# Altium project S6.PrjPCB
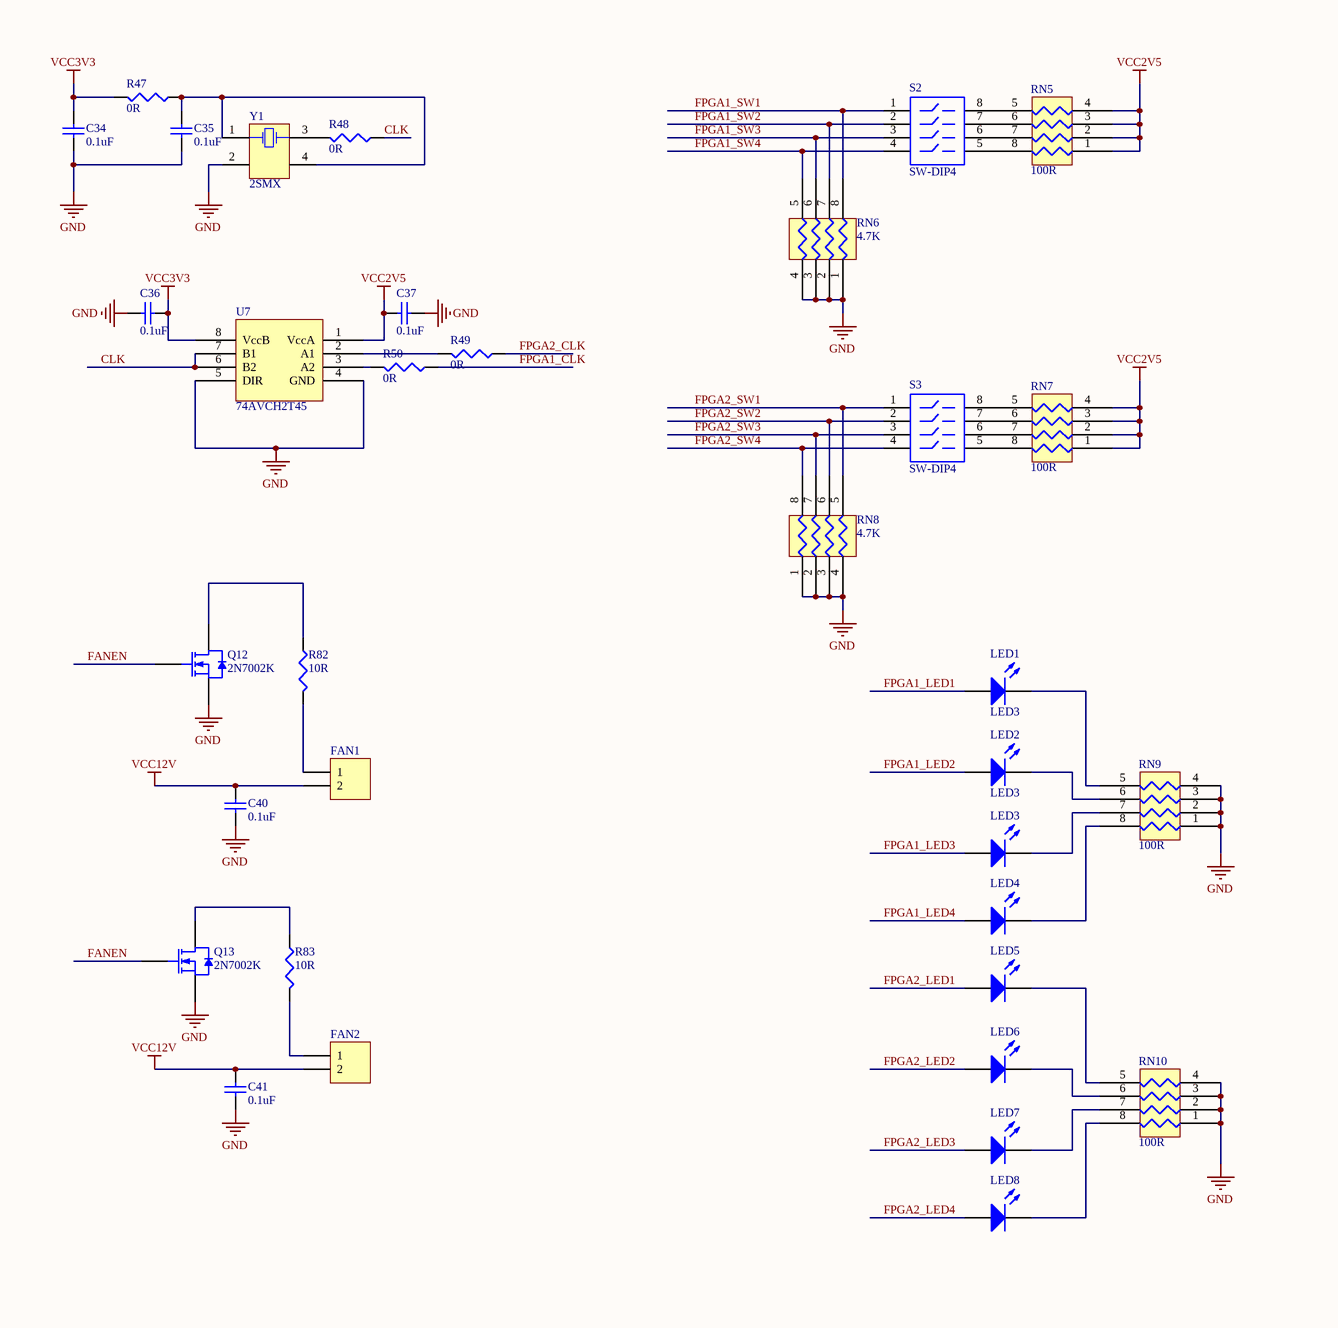
[diagram p0: S6.SchDoc, left]
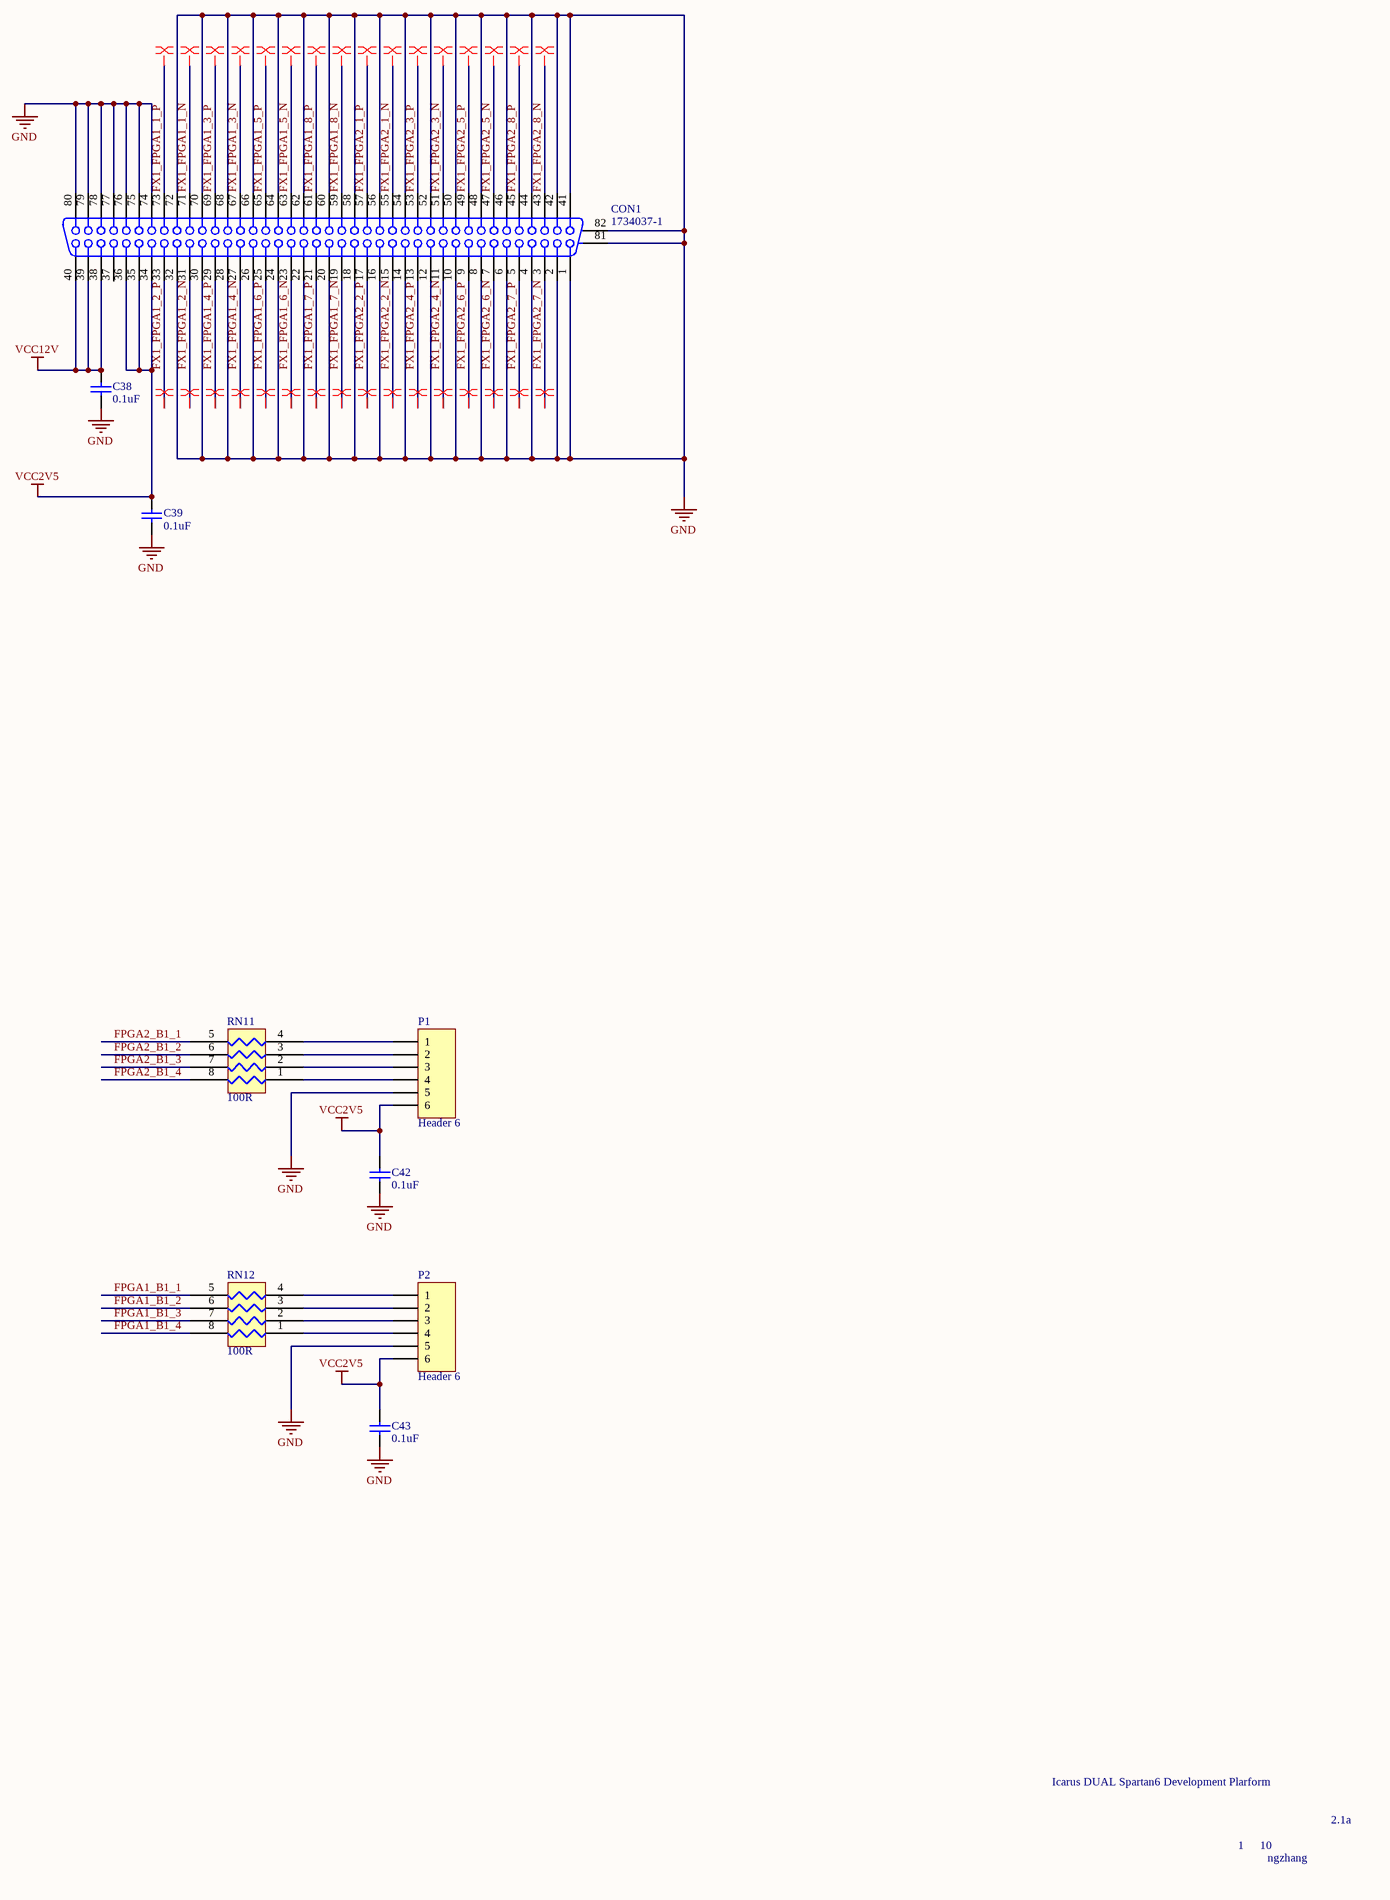
[diagram p1: S6.SchDoc, right]
7 sheets, 298 parts. Net scope: global (net labels, ports and power ports of the same name join across sheets).
Board file: S6.PcbDoc
Sheets:
  S6.SchDoc
  POWER_IO.SchDoc
  POWER.SchDoc
  DIMM_CONNECTOR.SchDoc
  USB2UART.SchDoc
  FPGA1_POWER.SchDoc
  FPGA2_POWER.SchDoc

## Sheet S6.SchDoc
size A2

### Parts
C34  0.1uF  [1608[0603]]
C35  0.1uF  [1608[0603]]
C36  0.1uF  [1608[0603]]
C37  0.1uF  [1608[0603]]
C38  0.1uF  [1608[0603]]
C39  0.1uF  [1608[0603]]
C40  0.1uF  [1608[0603]]
C41  0.1uF  [1608[0603]]
C42  0.1uF  [1608[0603]]
C43  0.1uF  [1608[0603]]
CON1  1734037-1  [1734037-1]
FAN1  Header 2  [2PINFAN]  (value not drawn)
FAN2  Header 2  [2PINFAN]  (value not drawn)
LED1  LED3  [CD1608-0603]
LED2  LED3  [CD1608-0603]
LED3  LED3  [CD1608-0603]  (value not drawn)
LED4  LED3  [CD1608-0603]  (value not drawn)
LED5  LED3  [CD1608-0603]  (value not drawn)
LED6  LED3  [CD1608-0603]  (value not drawn)
LED7  LED3  [CD1608-0603]  (value not drawn)
LED8  LED3  [CD1608-0603]  (value not drawn)
P1  Header 6  [HDR1X6]
P2  Header 6  [HDR1X6]
Q12  2N7002K  [SOT23_N]
Q13  2N7002K  [SOT23_N]
R47  0R  [J1-0603]
R48  0R  [J1-0603]
R49  0R  [J1-0603]
R50  0R  [J1-0603]
R82  10R  [J1-0603]
R83  10R  [J1-0603]
RN5  100R  [EXBV8V]
RN6  4.7K  [EXBV8V]
RN7  100R  [EXBV8V]
RN8  4.7K  [EXBV8V]
RN9  100R  [EXBV8V]
RN10  100R  [EXBV8V]
RN11  100R  [EXBV8V]
RN12  100R  [EXBV8V]
S2  SW-DIP4  [SO8_N]
S3  SW-DIP4  [SO8_N]
U7  74AVCH2T45  [SOT765-1]
Y1  2SMX  [SMX2]

### Nets
GND: C34.1 C35.1 C36.2 C37.1 C38.1 C39.1 C40.2 C41.2 C42.1 C43.1 CON1.1 CON1.2 CON1.4 CON1.6 CON1.8 CON1.10 CON1.12 CON1.14 CON1.16 CON1.18 CON1.20 CON1.22 CON1.24 CON1.26 CON1.28 CON1.30 CON1.32 CON1.41 CON1.42 CON1.44 CON1.46 CON1.48 CON1.50 CON1.52 CON1.54 CON1.56 CON1.58 CON1.60 CON1.62 CON1.64 CON1.66 CON1.68 CON1.70 CON1.72 CON1.74 CON1.75 CON1.76 CON1.77 CON1.78 CON1.79 CON1.80 CON1.81(MH1) CON1.82(MH2) P1.5 P2.5 Q12.2(S) Q13.2(S) RN6.1 RN6.2 RN6.3 RN6.4 RN8.1 RN8.2 RN8.3 RN8.4 RN9.1 RN9.2 RN9.3 RN9.4 RN10.1 RN10.2 RN10.3 RN10.4 U7.4(GND) U7.5(DIR) Y1.2(NC)
VCC2V5: C37.2 C39.2 C42.2 C43.2 CON1.34 CON1.35 CON1.36 P1.6 P2.6 RN5.1 RN5.2 RN5.3 RN5.4 RN7.1 RN7.2 RN7.3 RN7.4 U7.1(VccA)  [project net VREF_OUT]
VCC3V3: C34.2 C36.1 R47.2 U7.8(VccB)
VCC12V: C38.2 C40.1 C41.1 CON1.38 CON1.39 CON1.40 FAN1.2 FAN2.2
CLK: R48.1 U7.6(B2) U7.7(B1)
FANEN: Q12.1(G) Q13.1(G)
FPGA1_B1_1: RN12.5
FPGA1_B1_2: RN12.6
FPGA1_B1_3: RN12.7
FPGA1_B1_4: RN12.8
FPGA1_CLK: R50.1
FPGA1_LED1: LED1.1(A)
FPGA1_LED2: LED2.1(A)
FPGA1_LED3: LED3.1(A)
FPGA1_LED4: LED4.1(A)
FPGA1_SW1: RN6.8 S2.1
FPGA1_SW2: RN6.7 S2.2
FPGA1_SW3: RN6.6 S2.3
FPGA1_SW4: RN6.5 S2.4
FPGA2_B1_1: RN11.5
FPGA2_B1_2: RN11.6
FPGA2_B1_3: RN11.7
FPGA2_B1_4: RN11.8
FPGA2_CLK: R49.1
FPGA2_LED1: LED5.1(A)
FPGA2_LED2: LED6.1(A)
FPGA2_LED3: LED7.1(A)
FPGA2_LED4: LED8.1(A)
FPGA2_SW1: RN8.5 S3.1
FPGA2_SW2: RN8.6 S3.2
FPGA2_SW3: RN8.7 S3.3
FPGA2_SW4: RN8.8 S3.4
FX1_FPGA1_1_N: CON1.71
FX1_FPGA1_1_P: CON1.73
FX1_FPGA1_2_N: CON1.31
FX1_FPGA1_2_P: CON1.33
FX1_FPGA1_3_N: CON1.67
FX1_FPGA1_3_P: CON1.69
FX1_FPGA1_4_N: CON1.27
FX1_FPGA1_4_P: CON1.29
FX1_FPGA1_5_N: CON1.63
FX1_FPGA1_5_P: CON1.65
FX1_FPGA1_6_N: CON1.23
FX1_FPGA1_6_P: CON1.25
FX1_FPGA1_7_N: CON1.19
FX1_FPGA1_7_P: CON1.21
FX1_FPGA1_8_N: CON1.59
FX1_FPGA1_8_P: CON1.61
FX1_FPGA2_1_N: CON1.55
FX1_FPGA2_1_P: CON1.57
FX1_FPGA2_2_N: CON1.15
FX1_FPGA2_2_P: CON1.17
FX1_FPGA2_3_N: CON1.51
FX1_FPGA2_3_P: CON1.53
FX1_FPGA2_4_N: CON1.11
FX1_FPGA2_4_P: CON1.13
FX1_FPGA2_5_N: CON1.47
FX1_FPGA2_5_P: CON1.49
FX1_FPGA2_6_N: CON1.7
FX1_FPGA2_6_P: CON1.9
FX1_FPGA2_7_N: CON1.3
FX1_FPGA2_7_P: CON1.5
FX1_FPGA2_8_N: CON1.43
FX1_FPGA2_8_P: CON1.45
NetC35_2: C35.2 R47.1 Y1.1(OSC1) Y1.4(NC)
NetFAN1_1: FAN1.1 R82.2
NetFAN2_1: FAN2.1 R83.2
NetLED1_2: LED1.2(K) RN9.5
NetLED2_2: LED2.2(K) RN9.6
NetLED3_2: LED3.2(K) RN9.7
NetLED4_2: LED4.2(K) RN9.8
NetLED5_2: LED5.2(K) RN10.5
NetLED6_2: LED6.2(K) RN10.6
NetLED7_2: LED7.2(K) RN10.7
NetLED8_2: LED8.2(K) RN10.8
NetP1_1: P1.1 RN11.4
NetP1_2: P1.2 RN11.3
NetP1_3: P1.3 RN11.2
NetP1_4: P1.4 RN11.1
NetP2_1: P2.1 RN12.4
NetP2_2: P2.2 RN12.3
NetP2_3: P2.3 RN12.2
NetP2_4: P2.4 RN12.1
NetQ12_3: Q12.3(D) R82.1
NetQ13_3: Q13.3(D) R83.1
NetR48_2: R48.2 Y1.3(OSC2)
NetR49_2: R49.2 U7.2(A1)
NetR50_2: R50.2 U7.3(A2)
NetRN5_5: RN5.5 S2.8
NetRN5_6: RN5.6 S2.7
NetRN5_7: RN5.7 S2.6
NetRN5_8: RN5.8 S2.5
NetRN7_5: RN7.5 S3.8
NetRN7_6: RN7.6 S3.7
NetRN7_7: RN7.7 S3.6
NetRN7_8: RN7.8 S3.5

Not connected (* = marked no-connect by the designer): CON1 37

### Layout directives
differential pair: FX1_FPGA1_1_N, FX1_FPGA1_1_P, FX1_FPGA1_2_N, FX1_FPGA1_2_P, FX1_FPGA1_3_N, FX1_FPGA1_3_P, FX1_FPGA1_4_N, FX1_FPGA1_4_P, FX1_FPGA1_5_N, FX1_FPGA1_5_P, FX1_FPGA1_6_N, FX1_FPGA1_6_P, FX1_FPGA1_7_N, FX1_FPGA1_7_P, FX1_FPGA1_8_N, FX1_FPGA1_8_P, FX1_FPGA2_1_N, FX1_FPGA2_1_P, FX1_FPGA2_2_N, FX1_FPGA2_2_P, FX1_FPGA2_3_N, FX1_FPGA2_3_P, FX1_FPGA2_4_N, FX1_FPGA2_4_P, FX1_FPGA2_5_N, FX1_FPGA2_5_P, FX1_FPGA2_6_N, FX1_FPGA2_6_P, FX1_FPGA2_7_N, FX1_FPGA2_7_P, FX1_FPGA2_8_N, FX1_FPGA2_8_P

### Notes on the sheet
- Icarus DUAL Spartan6 Development Plarform
- 1
- 10
- ngzhang
- 2.1a

### Library data of the parts
C34-C43 = Cap Semi: Capacitor (Semiconductor SIM Model); Published: 8-Jun-2000; LatestRevisionDate: 29-May-2009; LatestRevisionNote: IPC-7351 Footprint Added.; PackageReference: C1206; Publisher: Altium Limited; PackageDescription: Chip Capacitor; Value: 0.1uF
FAN1 FAN2 = Header 2: Header, 2-Pin; LatestRevisionDate: 17-Jul-2002; LatestRevisionNote: Re-released for DXP Platform.; Publisher: Altium Limited
LED1-LED8 = LED3: Typical BLUE SiC LED; Published: 8-Jun-2000; LatestRevisionDate: 17-Dec-2003; LatestRevisionNote: PCB Footprint replaced.; DatasheetVersion: 16-Apr-2002; PackageVersion: 16-Apr-2002; PackageReference: 3.5X2.8X1.9; Publisher: Altium Limited; PackageDescription: SM LED; 2 C-Bend Leads; Body 3.5 x 2.8 x 1.9 mm, inc leads (LxWxH typ)
P1 P2 = Header 6: Header, 6-Pin; LatestRevisionDate: 17-Jul-2002; LatestRevisionNote: Re-released for DXP Platform.; Publisher: Altium Limited
Q12 Q13 = 2N7002: N-channel Enhancement Mode Field-effect Transistor; Published: 17-Sep-2003; LatestRevisionDate: 12-Dec-2006; LatestRevisionNote: IPC-7351 Footprint Added.; DatasheetVersion: 27-Jul-2000; PackageVersion: May-1999; PackageReference: SOT23; Publisher: Altium Limited; PackageDescription: 3-Pin SOT-23 Package 0.95 mm Pitch, 2.3 mm Lead Span; ComponentLink1Description: Manufacturer Link; ComponentLink1URL: http://www.semiconductors.philips.com/; ComponentLink2Description: Datasheet; ComponentLink2URL: http://www.semiconductors.philips.com/acrobat/datasheets/2N7002_4.pdf
R47-R50 R82 R83 = Res3: Resistor; Published: 8-Jun-2000; LatestRevisionDate: 29-May-2009; LatestRevisionNote: IPC-7351 Footprint Added.; PackageReference: J1-0603; Publisher: Altium Limited; PackageDescription: Chip Resistor
  R47-R50: Value: 0R
  R82 R83: Value: 10R
RN5-RN12 = RES4PACK
S2 S3 = SW-DIP4: DIP Switch; Published: 24-Mar-1999; LatestRevisionDate: 17-Jul-2002; LatestRevisionNote: Re-released for DXP Platform.; PackageReference: DIP-8; Publisher: Altium Limited
Y1 = 2SMX: Surface Mount Quartz Crystal; Note: PCB layout complies with manufacturer's recommendation.; Published: 17-Jul-2002; DatasheetDocument: 9-Sep-1999; PackageDocument: 9-Sep-1999; PackageReference: 2SMX; Publisher: Altium Limited; ComponentLink1Description: Manufacturer Link; ComponentLink1URL: http://www.cmac.com/mt/

## Sheet POWER_IO.SchDoc
size A4
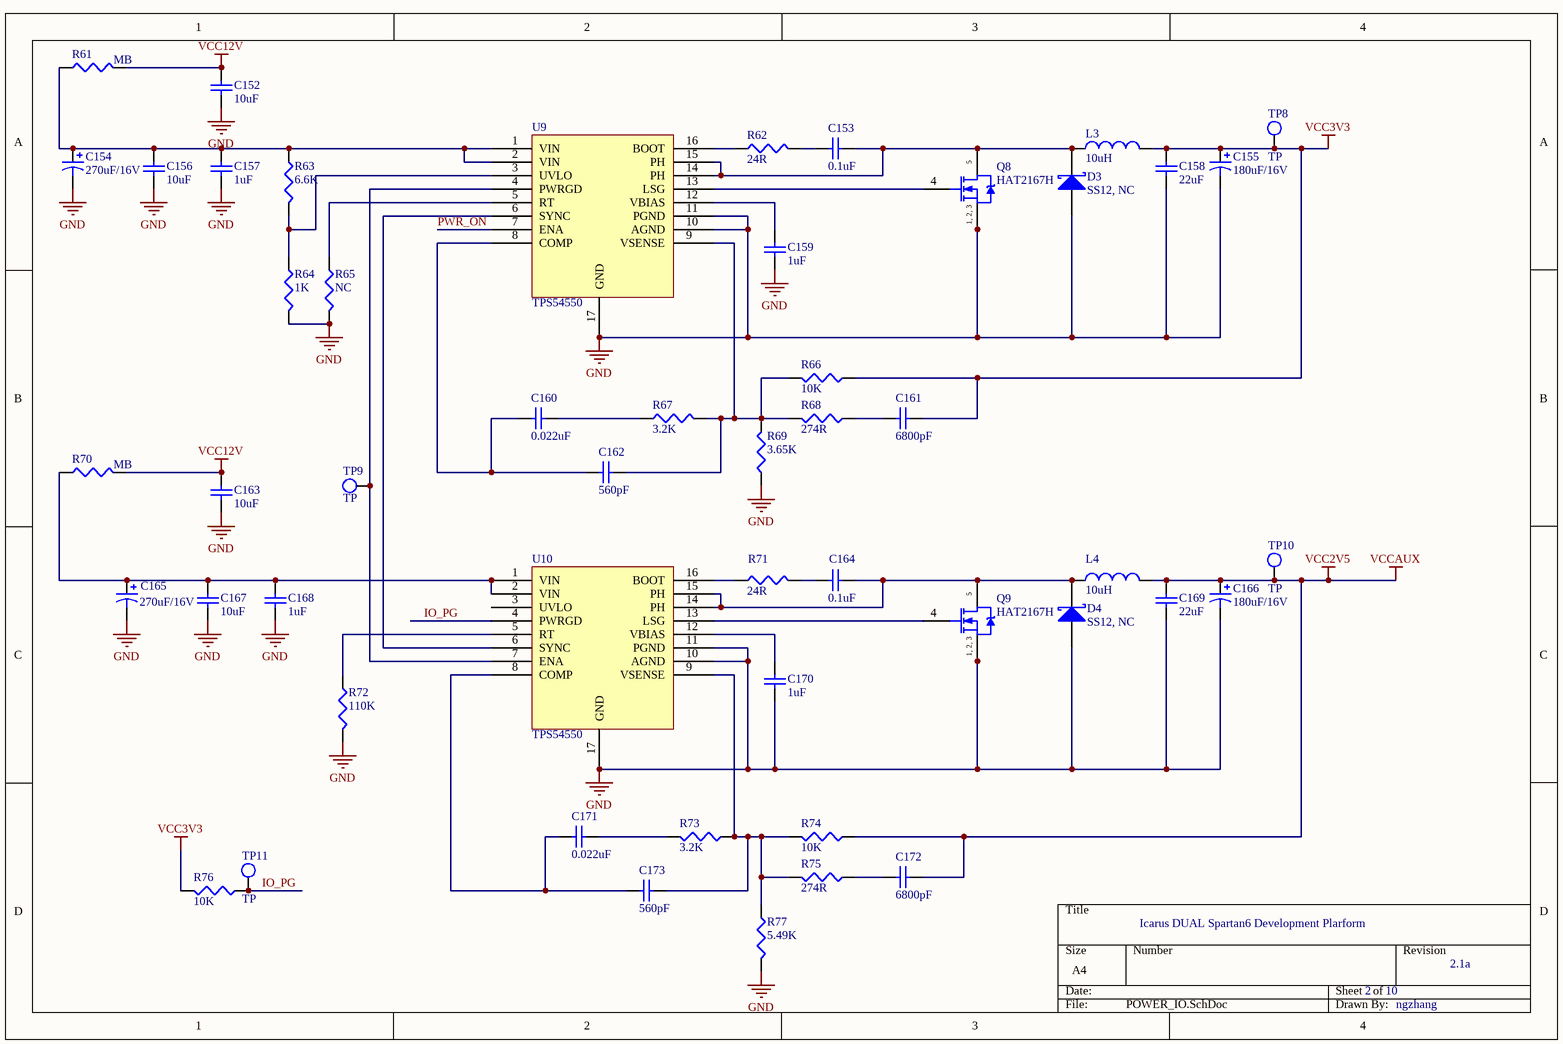
[diagram p2: POWER_IO.SchDoc]

### Parts
C152  10uF  [C1206]
C153  0.1uF  [1608[0603]]
C154  270uF/16V  [CAP8X8]
C155  180uF/16V  [CAP8X8]
C156  10uF  [C1206]
C157  1uF  [1608[0603]]
C158  22uF  [C1206]
C159  1uF  [1608[0603]]
C160  0.022uF  [1608[0603]]
C161  6800pF  [1608[0603]]
C162  560pF  [1608[0603]]
C163  10uF  [C1206]
C164  0.1uF  [1608[0603]]
C165  270uF/16V  [CAP8X8]
C166  180uF/16V  [CAP8X8]
C167  10uF  [C1206]
C168  1uF  [1608[0603]]
C169  22uF  [C1206]
C170  1uF  [1608[0603]]
C171  0.022uF  [1608[0603]]
C172  6800pF  [1608[0603]]
C173  560pF  [1608[0603]]
D3  SS12, NC  [SMA]
D4  SS12, NC  [SMA]
L3  value 10uH  [IHLP4040]  (hidden comment: IHLP4040DZ11)
L4  value 10uH  [IHLP4040]  (hidden comment: IHLP4040DZ11)
Q8  HAT2167H  [LFPAK]
Q9  HAT2167H  [LFPAK]
R61  MB  [C1206]
R62  24R  [J1-0603]
R63  6.6K  [J1-0603]
R64  1K  [J1-0603]
R65  NC  [J1-0603]
R66  10K  [J1-0603]
R67  3.2K  [J1-0603]
R68  274R  [J1-0603]
R69  3.65K  [J1-0603]
R70  MB  [C1206]
R71  24R  [J1-0603]
R72  110K  [J1-0603]
R73  3.2K  [J1-0603]
R74  10K  [J1-0603]
R75  274R  [J1-0603]
R76  10K  [J1-0603]
R77  5.49K  [J1-0603]
TP8  TP  [TP]
TP9  TP  [TP]
TP10  TP  [TP]
TP11  TP  [TP]
U9  TPS54550  [TSSOP16_PP]
U10  TPS54550  [TSSOP16_PP]

### Nets
GND: C152.1 C154.2 C155.2 C156.1 C157.1 C158.1 C159.1 C163.1 C165.2 C166.2 C167.1 C168.1 C169.1 C170.2 D3.1(A) D4.1(A) Q8.1(S) Q8.2(S) Q8.3(S) Q9.1(S) Q9.2(S) Q9.3(S) R64.2 R65.2 R69.1 R72.2 R77.2 U9.10(AGND) U9.11(PGND) U9.17(GND) U10.10(AGND) U10.11(PGND) U10.17(GND)
VCC2V5: C166.1 C169.2 C172.2 L4.2 R74.1 TP10.1(TP)  [also labelled VCCAUX]  [project net VREF_OUT]
VCC3V3: C155.1 C158.2 C161.2 L3.2 R66.1 R76.2 TP8.1(TP)
VCC12V: C152.2 C163.2 R61.2 R70.2
IO_PG: R76.1 TP11.1(TP) U10.4(PWRGD)
PWR_ON: U9.7(ENA)
NetC153_1: C153.1 R62.2
NetC153_2: C153.2 D3.2(K) L3.1 Q8.5(D) U9.14(PH) U9.15(PH)
NetC154_1: C154.1 C156.2 C157.2 R61.1 R63.1 U9.1(VIN) U9.2(VIN)
NetC159_2: C159.2 U9.12(VBIAS)
NetC160_1: C160.1 C162.1 U9.8(COMP)
NetC160_2: C160.2 R67.1
NetC161_1: C161.1 R68.1
NetC162_2: C162.2 R66.2 R67.2 R68.2 R69.2 U9.9(VSENSE)
NetC164_1: C164.1 D4.2(K) L4.1 Q9.5(D) U10.14(PH) U10.15(PH)
NetC164_2: C164.2 R71.2
NetC165_1: C165.1 C167.2 C168.2 R70.1 U10.1(VIN) U10.2(VIN)
NetC170_1: C170.1 U10.12(VBIAS)
NetC171_1: C171.1 C173.1 U10.8(COMP)
NetC171_2: C171.2 R73.2
NetC172_1: C172.1 R75.1
NetC173_2: C173.2 R73.1 R74.2 R75.2 R77.1 U10.9(VSENSE)
NetQ8_4: Q8.4(G) U9.13(LSG)
NetQ9_4: Q9.4(G) U10.13(LSG)
NetR62_1: R62.1 U9.16(BOOT)
NetR63_2: R63.2 R64.1 U9.3(UVLO)
NetR65_1: R65.1 U9.5(RT)
NetR71_1: R71.1 U10.16(BOOT)
NetR72_1: R72.1 U10.5(RT)
NetTP9_1: TP9.1(TP) U9.4(PWRGD) U10.7(ENA)
NetU9_6: U9.6(SYNC) U10.6(SYNC)

Not connected (* = marked no-connect by the designer): U10 3(UVLO)

### Notes on the sheet
- Icarus DUAL Spartan6 Development Plarform
- 2
- 10
- 2.1a
- ngzhang
- (in symbol HAT216X) 1, 2, 3

### Library data of the parts
C152 C153 C156-C164 C167-C173 = Cap Semi: Capacitor (Semiconductor SIM Model); Published: 8-Jun-2000; LatestRevisionDate: 29-May-2009; LatestRevisionNote: IPC-7351 Footprint Added.; PackageReference: C1206; Publisher: Altium Limited; PackageDescription: Chip Capacitor
  C152 C156 C163 C167: Value: 10uF
  C153 C164: Value: 0.1uF
  C157 C159 C168 C170: Value: 1uF
  C158 C169: Value: 22uF
  C160 C171: Value: 0.022uF
  C161 C172: Value: 6800pF
  C162 C173: Value: 560pF
C154 C155 C165 C166 = Cap Pol3: Polarized Capacitor (Surface Mount); Published: 8-Jun-2000; LatestRevisionDate: 29-May-2009; LatestRevisionNote: IPC-7351 Footprint Added.; PackageReference: C0805; Publisher: Altium Limited; PackageDescription: Chip Capacitor
  C154 C165: Value: 270uF/16V
  C155 C166: Value: 180uF/16V
D3 D4 = 10MQ060N: Schottky Rectifier; Published: 17-Sep-2003; DatasheetVersion: May-2002; PackageVersion: revH, May-2002; PackageReference: SMA; Publisher: Altium Limited; PackageDescription: DO-214-AC/SMA; 2 C-Bend Leads; Body 5 x 2.7 mm, inc. leads (LxW); ComponentLink1Description: Manufacturer Link; ComponentLink1URL: http://www.irf.com/; ComponentLink2Description: Datasheet; ComponentLink2URL: http://www.irf.com/product-info/datasheets/data/10MQ060N.pdf
L3 L4 = Inductor: Code_IEC: 1005; Published: 8-Jun-2000; LatestRevisionDate: 29-May-2009; LatestRevisionNote: IPC-7351 Footprint Added.; PackageReference: 0402-A; Publisher: Altium Limited; PackageDescription: Chip Inductor; Code_JEITA: 0402
Q8 Q9 = HAT216X
R61-R77 = Res3: Resistor; Published: 8-Jun-2000; LatestRevisionDate: 29-May-2009; LatestRevisionNote: IPC-7351 Footprint Added.; PackageReference: J1-0603; Publisher: Altium Limited; PackageDescription: Chip Resistor
  R61 R70: Value: MB
  R62 R71: Value: 24R
  R63: Value: 6.6K
  R64: Value: 1K
  R65: Value: NC
  R66 R74 R76: Value: 10K
  R67 R73: Value: 3.2K
  R68 R75: Value: 274R
  R69: Value: 3.65K
  R72: Value: 110K
  R77: Value: 5.49K
U9 U10 = TPS54350

## Sheet POWER.SchDoc
size A3
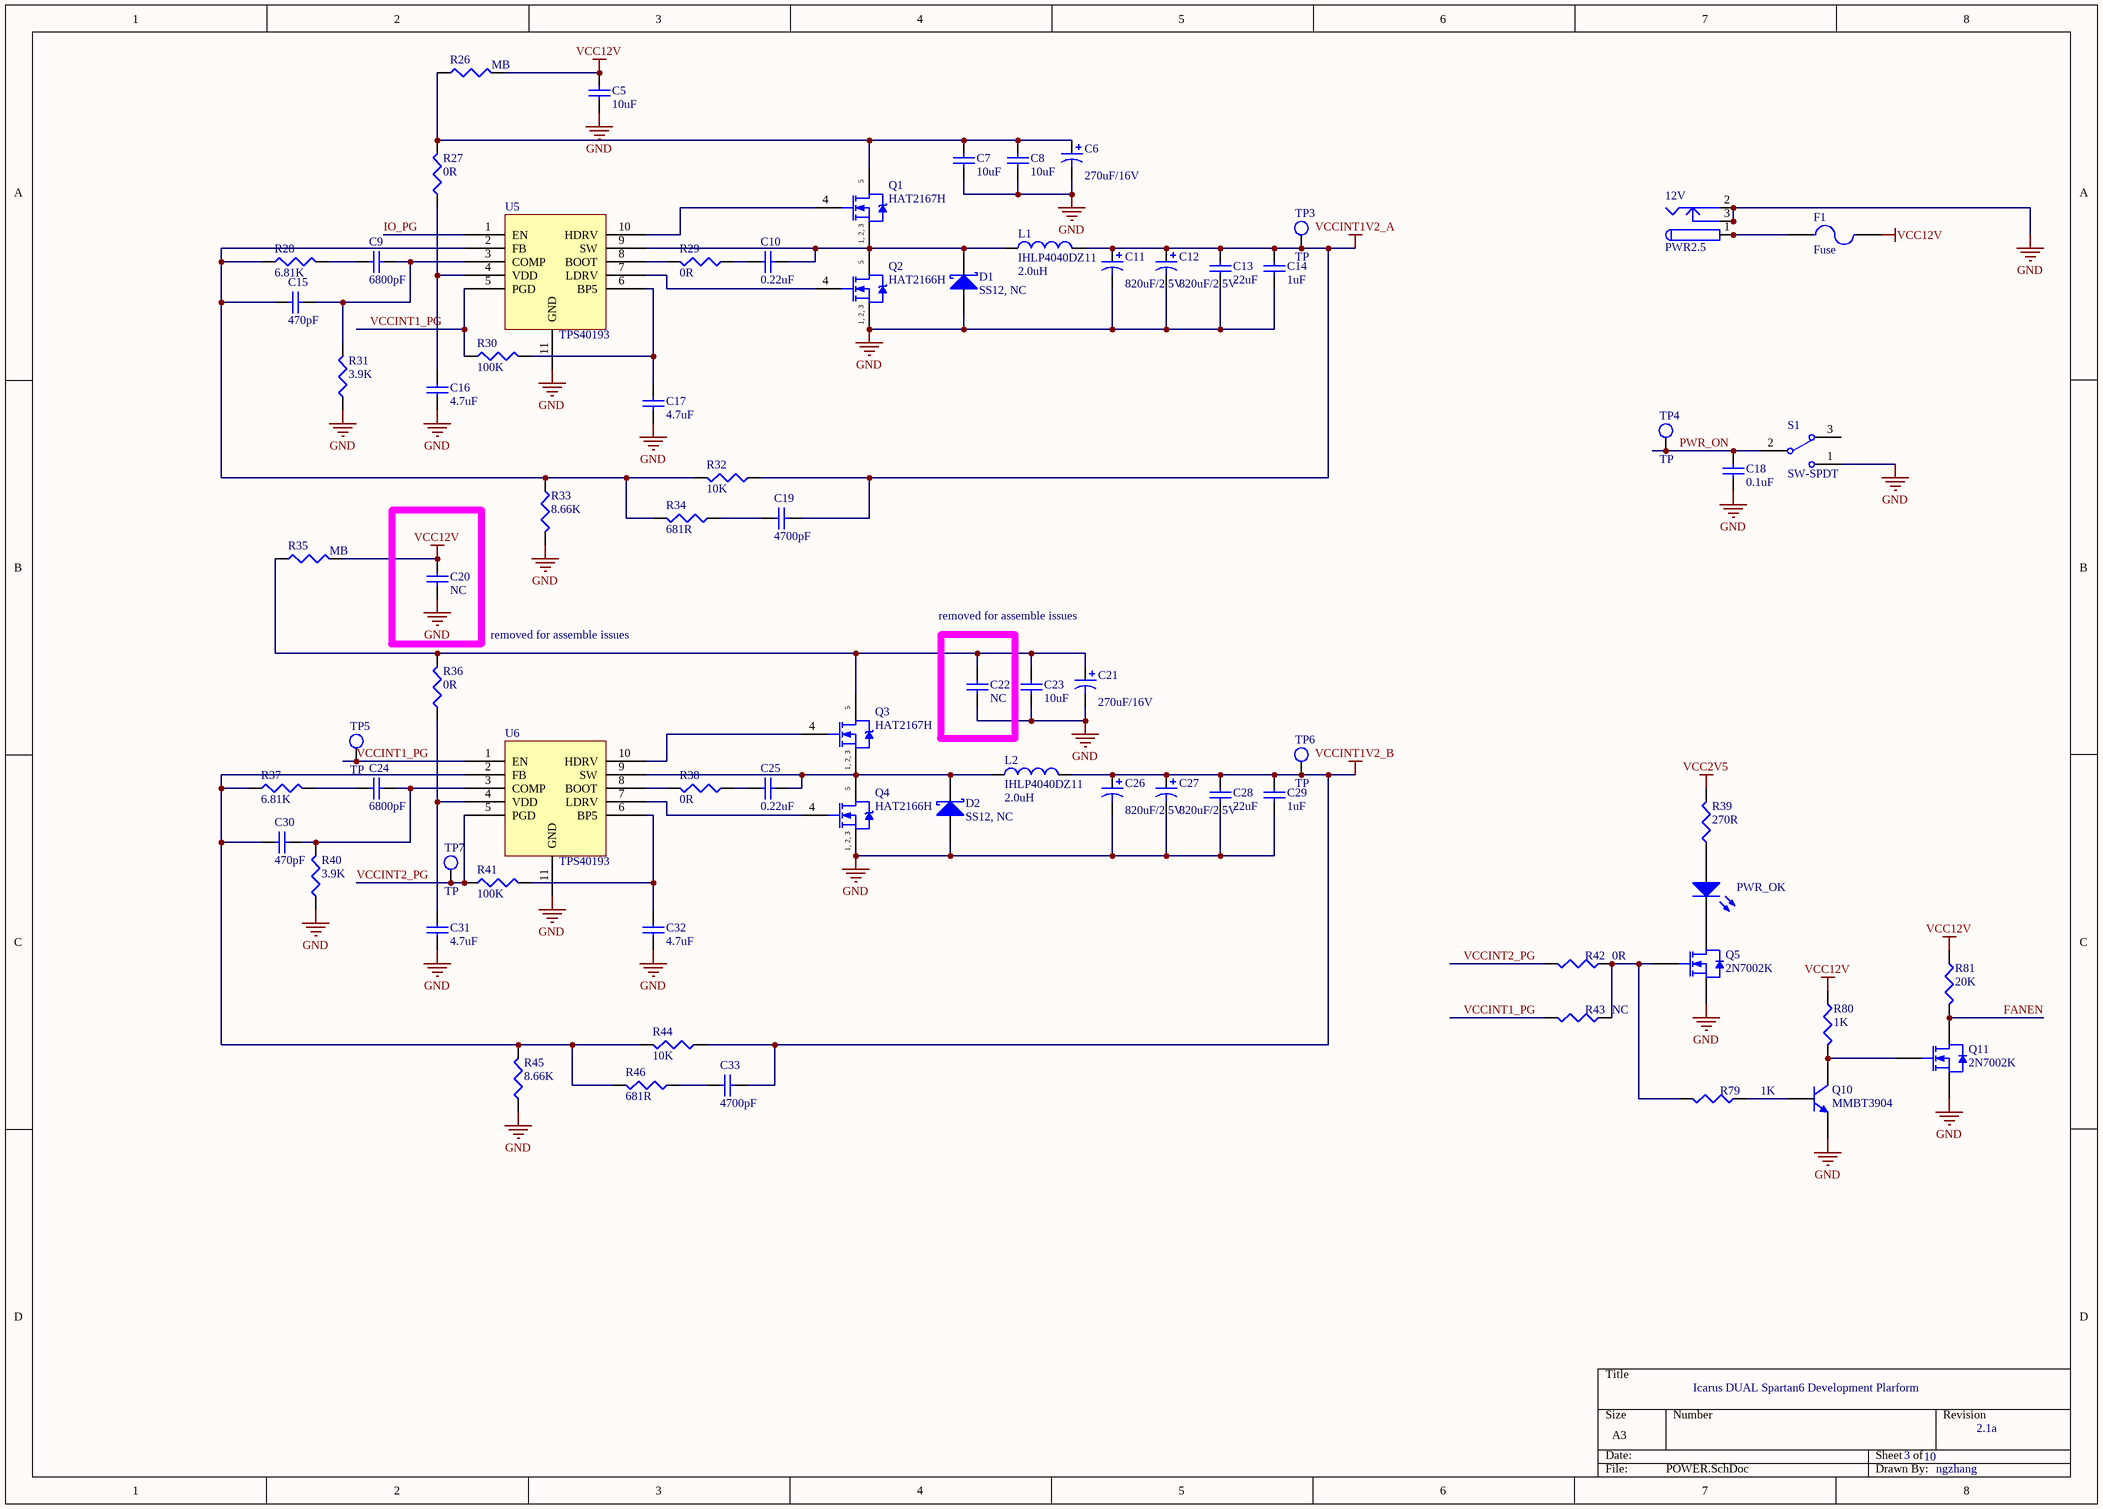
[diagram p3: POWER.SchDoc]

### Parts
12V  PWR2.5  [KLD-0202]
C5  10uF  [C1206]
C6  270uF/16V  [CAP8X8]
C7  10uF  [C1206]
C8  10uF  [C1206]
C9  6800pF  [1608[0603]]
C10  0.22uF  [1608[0603]]
C11  820uF/2.5V  [CAP8X8]
C12  820uF/2.5V  [CAP8X8]
C13  22uF  [C1206]
C14  1uF  [1608[0603]]
C15  470pF  [1608[0603]]
C16  4.7uF  [C0805]
C17  4.7uF  [C0805]
C18  0.1uF  [1608[0603]]
C19  4700pF  [1608[0603]]
C20  NC  [C1206]
C21  270uF/16V  [CAP8X8]
C22  NC  [C1206]
C23  10uF  [C1206]
C24  6800pF  [1608[0603]]
C25  0.22uF  [1608[0603]]
C26  820uF/2.5V  [CAP8X8]
C27  820uF/2.5V  [CAP8X8]
C28  22uF  [C1206]
C29  1uF  [1608[0603]]
C30  470pF  [1608[0603]]
C31  4.7uF  [C0805]
C32  4.7uF  [C0805]
C33  4700pF  [1608[0603]]
D1  SS12, NC  [SMA]
D2  SS12, NC  [SMA]
F1  Fuse  [12Z-2010]
L1  IHLP4040DZ11  value 2.0uH  [IHLP4040]
L2  IHLP4040DZ11  value 2.0uH  [IHLP4040]
PWR_OK  LED3  [CD1608-0603]  (value not drawn)
Q1  HAT2167H  [LFPAK]
Q2  HAT2166H  [LFPAK]
Q3  HAT2167H  [LFPAK]
Q4  HAT2166H  [LFPAK]
Q5  2N7002K  [SOT23_N]
Q10  MMBT3904  [SOT23_N]
Q11  2N7002K  [SOT23_N]
R26  MB  [C1206]
R27  0R  [J1-0603]
R28  6.81K  [J1-0603]
R29  0R  [J1-0603]
R30  100K  [J1-0603]
R31  3.9K  [J1-0603]
R32  10K  [J1-0603]
R33  8.66K  [J1-0603]
R34  681R  [J1-0603]
R35  MB  [C1206]
R36  0R  [J1-0603]
R37  6.81K  [J1-0603]
R38  0R  [J1-0603]
R39  270R  [J1-0603]
R40  3.9K  [J1-0603]
R41  100K  [J1-0603]
R42  0R  [J1-0603]
R43  NC  [J1-0603]
R44  10K  [J1-0603]
R45  8.66K  [J1-0603]
R46  681R  [J1-0603]
R79  1K  [J1-0603]
R80  1K  [J1-0603]
R81  20K  [J1-0603]
S1  SW-SPDT  [SW_3]
TP3  TP  [TP]
TP4  TP  [TP]
TP5  TP  [TP]
TP6  TP  [TP]
TP7  TP  [TP]
U5  TPS40193  [SON10]
U6  TPS40193  [SON10]

### Blocks framed on the sheet
removed for assemble issues: C22

### Nets
GND: 12V.2 12V.2A 12V.2B 12V.3 12V.3A 12V.3B C5.1 C6.2 C7.1 C8.1 C11.2 C12.2 C13.1 C14.1 C16.2 C17.1 C18.1 C20.1 C21.2 C22.1 C23.1 C26.2 C27.2 C28.1 C29.1 C31.1 C32.2 D1.1(A) D2.1(A) Q2.1(S) Q2.2(S) Q2.3(S) Q4.1(S) Q4.2(S) Q4.3(S) Q5.2(S) Q10.2(E) Q11.2(S) R31.1 R33.2 R40.1 R45.1 S1.1 U5.11(GND) U6.11(GND)
VCC2V5: R39.2  [project net VREF_OUT]
VCC12V: C5.2 C20.2 F1.2 R26.2 R35.2 R80.1 R81.1
VCCINT1V2_A: C11.1 C12.1 C13.2 C14.2 C19.2 L1.2 R32.1 TP3.1(TP)
VCCINT1V2_B: C26.1 C27.1 C28.2 C29.2 C33.2 L2.2 R44.1 TP6.1(TP)
FANEN: Q11.3(D) R81.2
IO_PG: U5.1(EN)
PWR_ON: C18.2 S1.2 TP4.1(TP)
VCCINT1_PG: R30.1 R43.2 TP5.1(TP) U5.5(PGD) U6.1(EN)
VCCINT2_PG: R41.1 R42.2 TP7.1(TP) U6.5(PGD)
Net12V_1: 12V.1 12V.1A 12V.1B F1.1
NetC6_1: C6.1 C7.2 C8.2 Q1.5(D) R26.1 R27.2
NetC9_1: C9.1 C15.1 R31.2 U5.3(COMP)
NetC9_2: C9.2 R28.2
NetC10_1: C10.1 D1.2(K) L1.1 Q1.1(S) Q1.2(S) Q1.3(S) Q2.5(D) U5.9(SW)
NetC10_2: C10.2 R29.1
NetC15_2: C15.2 R28.1 R32.2 R33.1 R34.2 U5.2(FB)
NetC16_1: C16.1 R27.1 U5.4(VDD)
NetC17_2: C17.2 R30.2 U5.6(BP5)
NetC19_1: C19.1 R34.1
NetC21_1: C21.1 C22.2 C23.2 Q3.5(D) R35.1 R36.2
NetC24_1: C24.1 C30.1 R40.2 U6.3(COMP)
NetC24_2: C24.2 R37.2
NetC25_1: C25.1 D2.2(K) L2.1 Q3.1(S) Q3.2(S) Q3.3(S) Q4.5(D) U6.9(SW)
NetC25_2: C25.2 R38.1
NetC30_2: C30.2 R37.1 R44.2 R45.2 R46.2 U6.2(FB)
NetC31_2: C31.2 R36.1 U6.4(VDD)
NetC32_1: C32.1 R41.2 U6.6(BP5)
NetC33_1: C33.1 R46.1
NetPWR_OK_1: PWR_OK.1(A) R39.1
NetPWR_OK_2: PWR_OK.2(K) Q5.3(D)
NetQ1_4: Q1.4(G) U5.10(HDRV)
NetQ2_4: Q2.4(G) U5.7(LDRV)
NetQ3_4: Q3.4(G) U6.10(HDRV)
NetQ4_4: Q4.4(G) U6.7(LDRV)
NetQ5_1: Q5.1(G) R42.1 R43.1 R79.2
NetQ10_1: Q10.1(B) R79.1
NetQ10_3: Q10.3(C) Q11.1(G) R80.2
NetR29_2: R29.2 U5.8(BOOT)
NetR38_2: R38.2 U6.8(BOOT)

Not connected (* = marked no-connect by the designer): S1 3

### Notes on the sheet
- removed for assemble issues
- Icarus DUAL Spartan6 Development Plarform
- 3
- 10
- 2.1a
- ngzhang
- (in symbol HAT216X) 1, 2, 3

### Library data of the parts
12V = PWR2.5: Low Voltage Power Supply Connector; Published: 17-Dec-2003; DatasheetDocument: 09-May-2002; Publisher: Altium Limited; ComponentLink1Description: Manufacturer Link; ComponentLink1URL: http://domino.kycon.com/internet/Products.html
C5 C7-C10 C13-C20 C22-C25 C28-C33 = Cap Semi: Capacitor (Semiconductor SIM Model); Published: 8-Jun-2000; LatestRevisionDate: 29-May-2009; LatestRevisionNote: IPC-7351 Footprint Added.; PackageReference: C1206; Publisher: Altium Limited; PackageDescription: Chip Capacitor
  C5 C7 C8 C23: Value: 10uF
  C9 C24: Value: 6800pF
  C10 C25: Value: 0.22uF
  C13 C28: Value: 22uF
  C14 C29: Value: 1uF
  C15 C30: Value: 470pF
  C16 C17 C31 C32: Value: 4.7uF
  C18: Value: 0.1uF
  C19 C33: Value: 4700pF
  C20 C22: Value: NC
C6 C11 C12 C21 C26 C27 = Cap Pol1: Polarized Capacitor (Radial); Published: 8-Jun-2000; LatestRevisionDate: 17-Jul-2002; LatestRevisionNote: Re-released for DXP Platform.; PackageReference: RB7.6-15; Publisher: Altium Limited; PackageDescription: Polarized Capacitor (Radial); 2 Leads
  C6 C21: Value: 270uF/16V
  C11 C12 C26 C27: Value: 820uF/2.5V
D1 D2 = 10MQ060N: Schottky Rectifier; Published: 17-Sep-2003; DatasheetVersion: May-2002; PackageVersion: revH, May-2002; PackageReference: SMA; Publisher: Altium Limited; PackageDescription: DO-214-AC/SMA; 2 C-Bend Leads; Body 5 x 2.7 mm, inc. leads (LxW); ComponentLink1Description: Manufacturer Link; ComponentLink1URL: http://www.irf.com/; ComponentLink2Description: Datasheet; ComponentLink2URL: http://www.irf.com/product-info/datasheets/data/10MQ060N.pdf
F1 = Fuse 2: Published: 8-Jun-2000; LatestRevisionDate: 17-Jul-2002; LatestRevisionNote: Re-released for DXP Platform.; PackageReference: PIN-W2/E2.8; Publisher: Altium Limited
L1 L2 = Inductor: Code_IEC: 1005; Published: 8-Jun-2000; LatestRevisionDate: 29-May-2009; LatestRevisionNote: IPC-7351 Footprint Added.; PackageReference: 0402-A; Publisher: Altium Limited; PackageDescription: Chip Inductor; Code_JEITA: 0402
PWR_OK = LED3: Typical BLUE SiC LED; Published: 8-Jun-2000; LatestRevisionDate: 17-Dec-2003; LatestRevisionNote: PCB Footprint replaced.; DatasheetVersion: 16-Apr-2002; PackageVersion: 16-Apr-2002; PackageReference: 3.5X2.8X1.9; Publisher: Altium Limited; PackageDescription: SM LED; 2 C-Bend Leads; Body 3.5 x 2.8 x 1.9 mm, inc leads (LxWxH typ)
Q1-Q4 = HAT216X
Q5 Q11 = 2N7002: as Q12 on sheet S6; Published: 17-Sep-2003; LatestRevisionDate: 12-Dec-2006; LatestRevisionNote: IPC-7351 Footprint Added.; DatasheetVersion: 27-Jul-2000; PackageVersion: May-1999; PackageReference: SOT23; Publisher: Altium Limited; PackageDescription: 3-Pin SOT-23 Package 0.95 mm Pitch, 2.3 mm Lead Span; ComponentLink1Description: Manufacturer Link; ComponentLink1URL: http://www.semiconductors.philips.com/; ComponentLink2Description: Datasheet; ComponentLink2URL: http://www.semiconductors.philips.com/acrobat/datasheets/2N7002_4.pdf
Q10 = MMBT3904: NPN Switching Transistor; Published: 17-Sep-2003; LatestRevisionDate: 12-Dec-2006; LatestRevisionNote: IPC-7351 Footprint Added.; DatasheetVersion: 13-May-2002; PackageVersion: May-1999; PackageReference: SOT23; Publisher: Altium Limited; PackageDescription: 3-Pin SOT-23 Package 0.95 mm Pitch, 2.3 mm Lead Span; ComponentLink1Description: Manufacturer Link; ComponentLink1URL: http://www.semiconductors.philips.com/; ComponentLink2Description: Datasheet; ComponentLink2URL: http://www.semiconductors.philips.com/acrobat/datasheets/MMBT3904_4.pdf
R26-R46 R79-R81 = Res3: Resistor; Published: 8-Jun-2000; LatestRevisionDate: 29-May-2009; LatestRevisionNote: IPC-7351 Footprint Added.; PackageReference: J1-0603; Publisher: Altium Limited; PackageDescription: Chip Resistor
  R26 R35: Value: MB
  R27 R29 R36 R38 R42: Value: 0R
  R28 R37: Value: 6.81K
  R30 R41: Value: 100K
  R31 R40: Value: 3.9K
  R32 R44: Value: 10K
  R33 R45: Value: 8.66K
  R34 R46: Value: 681R
  R39: Value: 270R
  R43: Value: NC
  R79 R80: Value: 1K
  R81: Value: 20K
S1 = SW-SPDT: SPDT Subminiature Toggle Switch, Right Angle Mounting, Vertical Actuation; Published: 24-Mar-1999; LatestRevisionDate: 17-Dec-2003; LatestRevisionNote: Schematic revised, PCB Footprint replaced.; DatasheetVersion: 05-Dec-2000; PackageReference: TL36WW15050; Publisher: Altium Limited; PackageDescription: Switch; 4 Leads; ComponentLink1Description: Manufacturer Link; ComponentLink1URL: http://www.apem.com

## Sheet DIMM_CONNECTOR.SchDoc
size A3
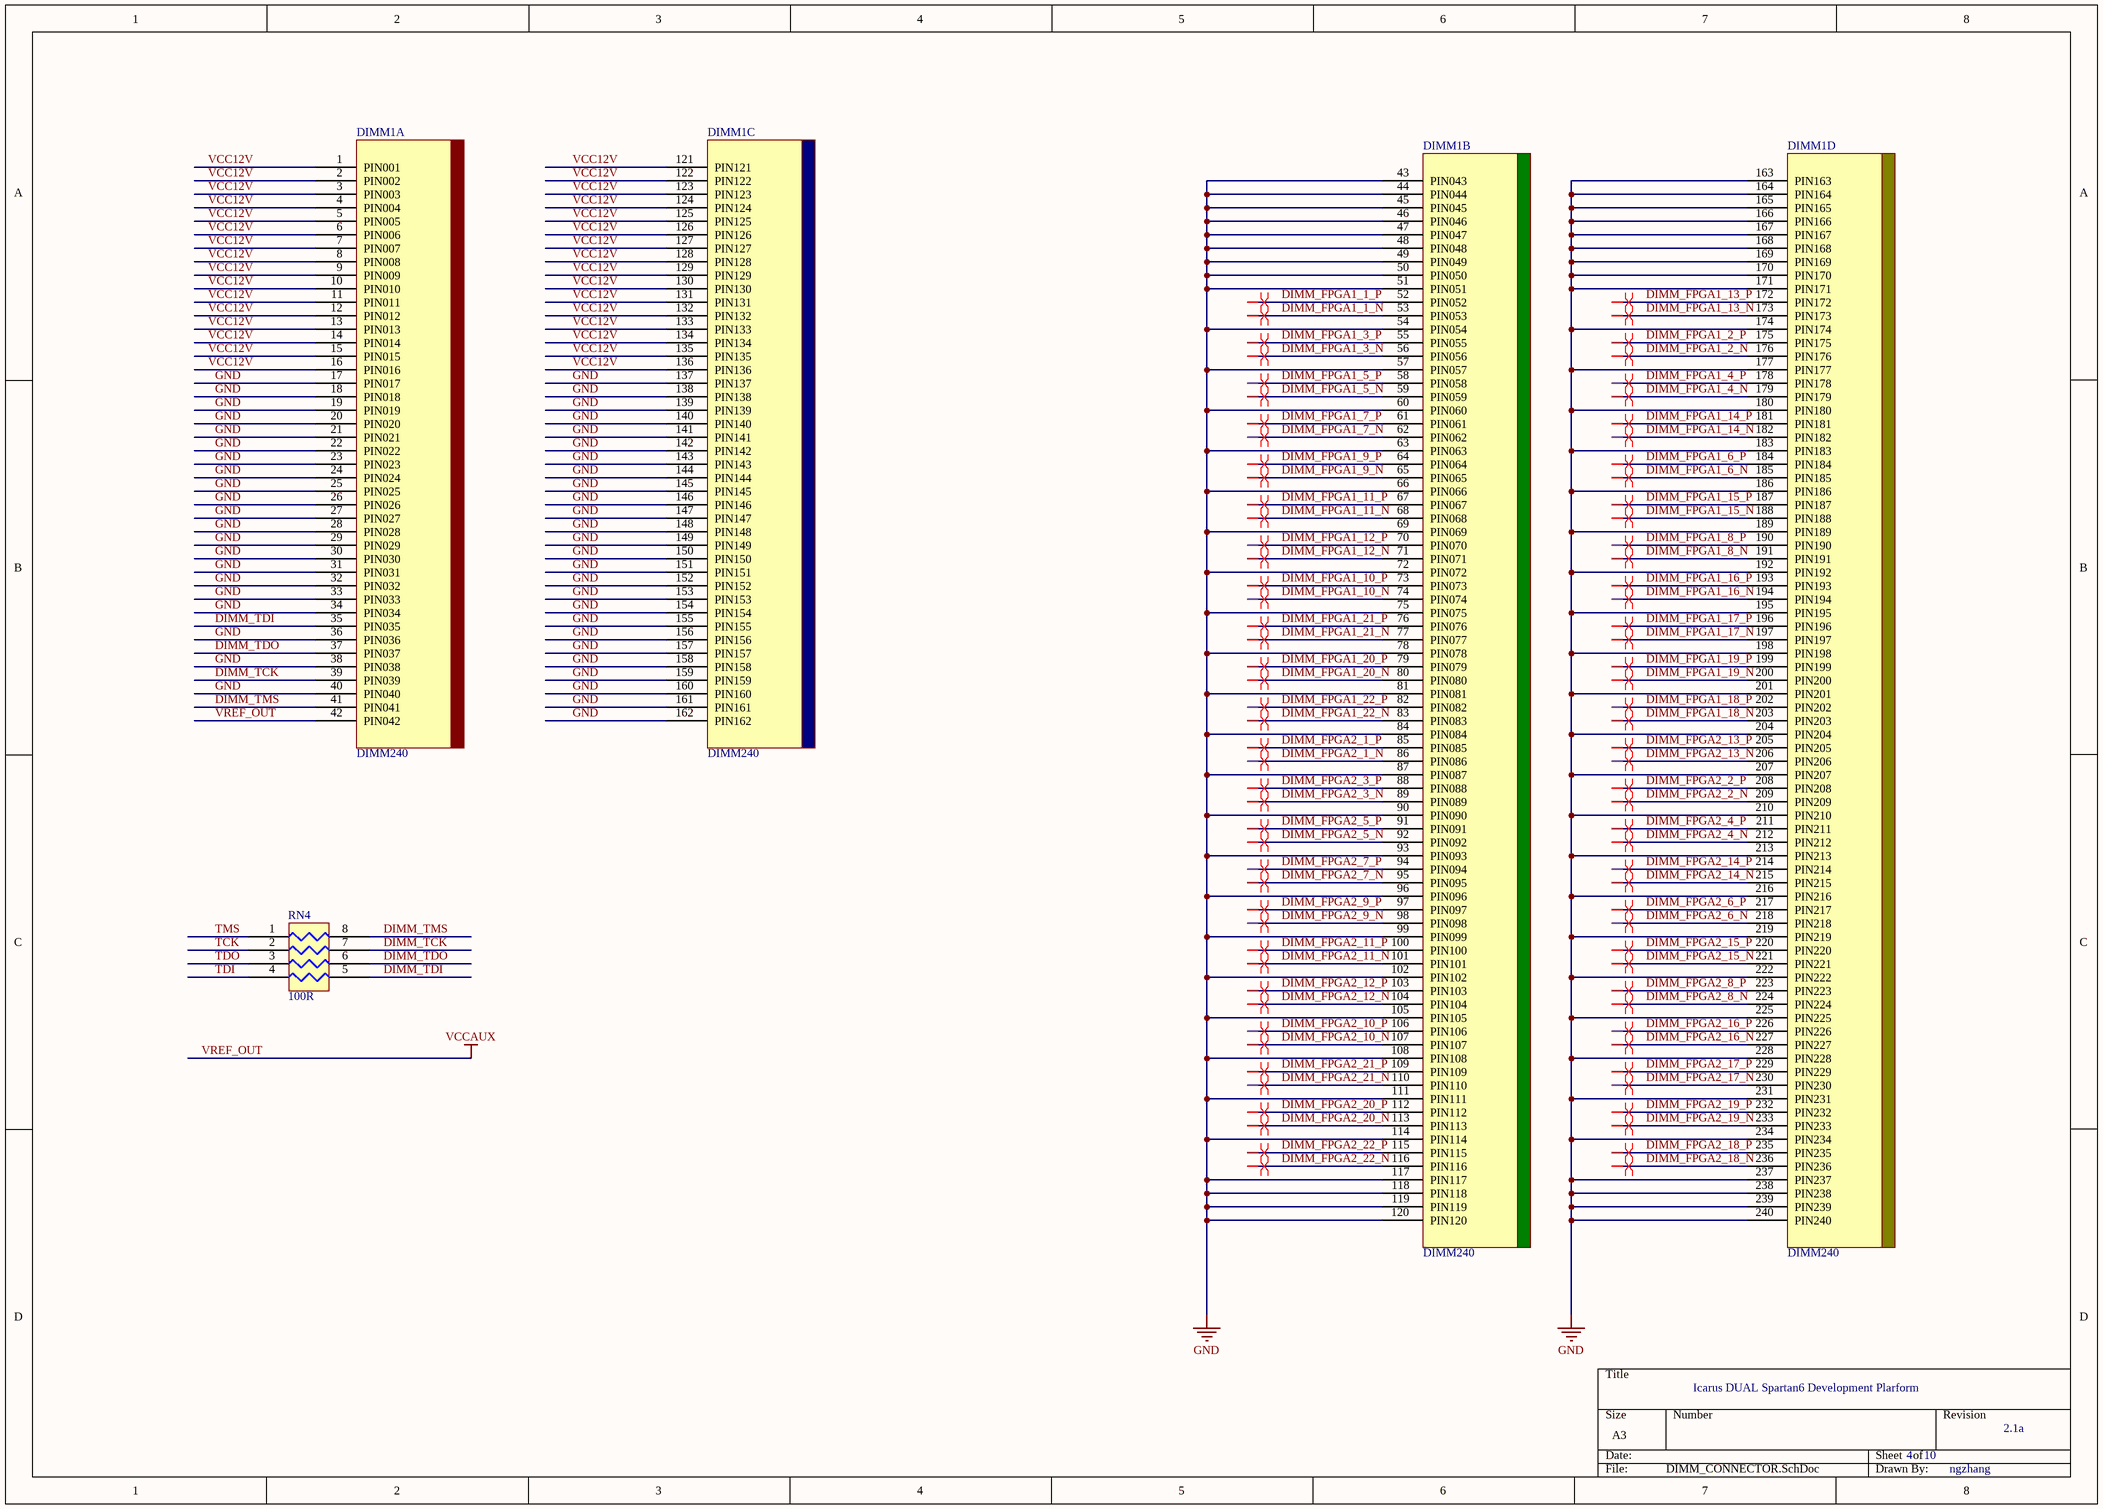
[diagram p4: DIMM_CONNECTOR.SchDoc]

### Parts
DIMM1  DIMM240  [DIMM240]  (parts A,B,C,D of 4)
RN4  100R  [EXBV8V]

### Nets
GND: DIMM1.17(PIN017) DIMM1.18(PIN018) DIMM1.19(PIN019) DIMM1.20(PIN020) DIMM1.21(PIN021) DIMM1.22(PIN022) DIMM1.23(PIN023) DIMM1.24(PIN024) DIMM1.25(PIN025) DIMM1.26(PIN026) DIMM1.27(PIN027) DIMM1.28(PIN028) DIMM1.29(PIN029) DIMM1.30(PIN030) DIMM1.31(PIN031) DIMM1.32(PIN032) DIMM1.33(PIN033) DIMM1.34(PIN034) DIMM1.36(PIN036) DIMM1.38(PIN038) DIMM1.40(PIN040) DIMM1.43(PIN043) DIMM1.44(PIN044) DIMM1.45(PIN045) DIMM1.46(PIN046) DIMM1.47(PIN047) DIMM1.48(PIN048) DIMM1.49(PIN049) DIMM1.50(PIN050) DIMM1.51(PIN051) DIMM1.54(PIN054) DIMM1.57(PIN057) DIMM1.60(PIN060) DIMM1.63(PIN063) DIMM1.66(PIN066) DIMM1.69(PIN069) DIMM1.72(PIN072) DIMM1.75(PIN075) DIMM1.78(PIN078) DIMM1.81(PIN081) DIMM1.84(PIN084) DIMM1.87(PIN087) DIMM1.90(PIN090) DIMM1.93(PIN093) DIMM1.96(PIN096) DIMM1.99(PIN099) DIMM1.102(PIN102) DIMM1.105(PIN105) DIMM1.108(PIN108) DIMM1.111(PIN111) DIMM1.114(PIN114) DIMM1.117(PIN117) DIMM1.118(PIN118) DIMM1.119(PIN119) DIMM1.120(PIN120) DIMM1.137(PIN137) DIMM1.138(PIN138) DIMM1.139(PIN139) DIMM1.140(PIN140) DIMM1.141(PIN141) DIMM1.142(PIN142) DIMM1.143(PIN143) DIMM1.144(PIN144) DIMM1.145(PIN145) DIMM1.146(PIN146) DIMM1.147(PIN147) DIMM1.148(PIN148) DIMM1.149(PIN149) DIMM1.150(PIN150) DIMM1.151(PIN151) DIMM1.152(PIN152) DIMM1.153(PIN153) DIMM1.154(PIN154) DIMM1.155(PIN155) DIMM1.156(PIN156) DIMM1.157(PIN157) DIMM1.158(PIN158) DIMM1.159(PIN159) DIMM1.160(PIN160) DIMM1.161(PIN161) DIMM1.162(PIN162) DIMM1.163(PIN163) DIMM1.164(PIN164) DIMM1.165(PIN165) DIMM1.166(PIN166) DIMM1.167(PIN167) DIMM1.168(PIN168) DIMM1.169(PIN169) DIMM1.170(PIN170) DIMM1.171(PIN171) DIMM1.174(PIN174) DIMM1.177(PIN177) DIMM1.180(PIN180) DIMM1.183(PIN183) DIMM1.186(PIN186) DIMM1.189(PIN189) DIMM1.192(PIN192) DIMM1.195(PIN195) DIMM1.198(PIN198) DIMM1.201(PIN201) DIMM1.204(PIN204) DIMM1.207(PIN207) DIMM1.210(PIN210) DIMM1.213(PIN213) DIMM1.216(PIN216) DIMM1.219(PIN219) DIMM1.222(PIN222) DIMM1.225(PIN225) DIMM1.228(PIN228) DIMM1.231(PIN231) DIMM1.234(PIN234) DIMM1.237(PIN237) DIMM1.238(PIN238) DIMM1.239(PIN239) DIMM1.240(PIN240)
VCC12V: DIMM1.1(PIN001) DIMM1.2(PIN002) DIMM1.3(PIN003) DIMM1.4(PIN004) DIMM1.5(PIN005) DIMM1.6(PIN006) DIMM1.7(PIN007) DIMM1.8(PIN008) DIMM1.9(PIN009) DIMM1.10(PIN010) DIMM1.11(PIN011) DIMM1.12(PIN012) DIMM1.13(PIN013) DIMM1.14(PIN014) DIMM1.15(PIN015) DIMM1.16(PIN016) DIMM1.121(PIN121) DIMM1.122(PIN122) DIMM1.123(PIN123) DIMM1.124(PIN124) DIMM1.125(PIN125) DIMM1.126(PIN126) DIMM1.127(PIN127) DIMM1.128(PIN128) DIMM1.129(PIN129) DIMM1.130(PIN130) DIMM1.131(PIN131) DIMM1.132(PIN132) DIMM1.133(PIN133) DIMM1.134(PIN134) DIMM1.135(PIN135) DIMM1.136(PIN136)
VREF_OUT: DIMM1.42(PIN042)  [also labelled VCCAUX]
DIMM_FPGA1_1_N: DIMM1.53(PIN053)
DIMM_FPGA1_1_P: DIMM1.52(PIN052)
DIMM_FPGA1_2_N: DIMM1.176(PIN176)
DIMM_FPGA1_2_P: DIMM1.175(PIN175)
DIMM_FPGA1_3_N: DIMM1.56(PIN056)
DIMM_FPGA1_3_P: DIMM1.55(PIN055)
DIMM_FPGA1_4_N: DIMM1.179(PIN179)
DIMM_FPGA1_4_P: DIMM1.178(PIN178)
DIMM_FPGA1_5_N: DIMM1.59(PIN059)
DIMM_FPGA1_5_P: DIMM1.58(PIN058)
DIMM_FPGA1_6_N: DIMM1.185(PIN185)
DIMM_FPGA1_6_P: DIMM1.184(PIN184)
DIMM_FPGA1_7_N: DIMM1.62(PIN062)
DIMM_FPGA1_7_P: DIMM1.61(PIN061)
DIMM_FPGA1_8_N: DIMM1.191(PIN191)
DIMM_FPGA1_8_P: DIMM1.190(PIN190)
DIMM_FPGA1_9_N: DIMM1.65(PIN065)
DIMM_FPGA1_9_P: DIMM1.64(PIN064)
DIMM_FPGA1_10_N: DIMM1.74(PIN074)
DIMM_FPGA1_10_P: DIMM1.73(PIN073)
DIMM_FPGA1_11_N: DIMM1.68(PIN068)
DIMM_FPGA1_11_P: DIMM1.67(PIN067)
DIMM_FPGA1_12_N: DIMM1.71(PIN071)
DIMM_FPGA1_12_P: DIMM1.70(PIN070)
DIMM_FPGA1_13_N: DIMM1.173(PIN173)
DIMM_FPGA1_13_P: DIMM1.172(PIN172)
DIMM_FPGA1_14_N: DIMM1.182(PIN182)
DIMM_FPGA1_14_P: DIMM1.181(PIN181)
DIMM_FPGA1_15_N: DIMM1.188(PIN188)
DIMM_FPGA1_15_P: DIMM1.187(PIN187)
DIMM_FPGA1_16_N: DIMM1.194(PIN194)
DIMM_FPGA1_16_P: DIMM1.193(PIN193)
DIMM_FPGA1_17_N: DIMM1.197(PIN197)
DIMM_FPGA1_17_P: DIMM1.196(PIN196)
DIMM_FPGA1_18_N: DIMM1.203(PIN203)
DIMM_FPGA1_18_P: DIMM1.202(PIN202)
DIMM_FPGA1_19_N: DIMM1.200(PIN200)
DIMM_FPGA1_19_P: DIMM1.199(PIN199)
DIMM_FPGA1_20_N: DIMM1.80(PIN080)
DIMM_FPGA1_20_P: DIMM1.79(PIN079)
DIMM_FPGA1_21_N: DIMM1.77(PIN077)
DIMM_FPGA1_21_P: DIMM1.76(PIN076)
DIMM_FPGA1_22_N: DIMM1.83(PIN083)
DIMM_FPGA1_22_P: DIMM1.82(PIN082)
DIMM_FPGA2_1_N: DIMM1.86(PIN086)
DIMM_FPGA2_1_P: DIMM1.85(PIN085)
DIMM_FPGA2_2_N: DIMM1.209(PIN209)
DIMM_FPGA2_2_P: DIMM1.208(PIN208)
DIMM_FPGA2_3_N: DIMM1.89(PIN089)
DIMM_FPGA2_3_P: DIMM1.88(PIN088)
DIMM_FPGA2_4_N: DIMM1.212(PIN212)
DIMM_FPGA2_4_P: DIMM1.211(PIN211)
DIMM_FPGA2_5_N: DIMM1.92(PIN092)
DIMM_FPGA2_5_P: DIMM1.91(PIN091)
DIMM_FPGA2_6_N: DIMM1.218(PIN218)
DIMM_FPGA2_6_P: DIMM1.217(PIN217)
DIMM_FPGA2_7_N: DIMM1.95(PIN095)
DIMM_FPGA2_7_P: DIMM1.94(PIN094)
DIMM_FPGA2_8_N: DIMM1.224(PIN224)
DIMM_FPGA2_8_P: DIMM1.223(PIN223)
DIMM_FPGA2_9_N: DIMM1.98(PIN098)
DIMM_FPGA2_9_P: DIMM1.97(PIN097)
DIMM_FPGA2_10_N: DIMM1.107(PIN107)
DIMM_FPGA2_10_P: DIMM1.106(PIN106)
DIMM_FPGA2_11_N: DIMM1.101(PIN101)
DIMM_FPGA2_11_P: DIMM1.100(PIN100)
DIMM_FPGA2_12_N: DIMM1.104(PIN104)
DIMM_FPGA2_12_P: DIMM1.103(PIN103)
DIMM_FPGA2_13_N: DIMM1.206(PIN206)
DIMM_FPGA2_13_P: DIMM1.205(PIN205)
DIMM_FPGA2_14_N: DIMM1.215(PIN215)
DIMM_FPGA2_14_P: DIMM1.214(PIN214)
DIMM_FPGA2_15_N: DIMM1.221(PIN221)
DIMM_FPGA2_15_P: DIMM1.220(PIN220)
DIMM_FPGA2_16_N: DIMM1.227(PIN227)
DIMM_FPGA2_16_P: DIMM1.226(PIN226)
DIMM_FPGA2_17_N: DIMM1.230(PIN230)
DIMM_FPGA2_17_P: DIMM1.229(PIN229)
DIMM_FPGA2_18_N: DIMM1.236(PIN236)
DIMM_FPGA2_18_P: DIMM1.235(PIN235)
DIMM_FPGA2_19_N: DIMM1.233(PIN233)
DIMM_FPGA2_19_P: DIMM1.232(PIN232)
DIMM_FPGA2_20_N: DIMM1.113(PIN113)
DIMM_FPGA2_20_P: DIMM1.112(PIN112)
DIMM_FPGA2_21_N: DIMM1.110(PIN110)
DIMM_FPGA2_21_P: DIMM1.109(PIN109)
DIMM_FPGA2_22_N: DIMM1.116(PIN116)
DIMM_FPGA2_22_P: DIMM1.115(PIN115)
DIMM_TCK: DIMM1.39(PIN039) RN4.7
DIMM_TDI: DIMM1.35(PIN035) RN4.5
DIMM_TDO: DIMM1.37(PIN037) RN4.6
DIMM_TMS: DIMM1.41(PIN041) RN4.8
TCK: RN4.2
TDI: RN4.4
TDO: RN4.3
TMS: RN4.1

### Layout directives
differential pair: DIMM_FPGA1_1_N, DIMM_FPGA1_1_P, DIMM_FPGA1_2_N, DIMM_FPGA1_2_P, DIMM_FPGA1_3_N, DIMM_FPGA1_3_P, DIMM_FPGA1_4_N, DIMM_FPGA1_4_P, DIMM_FPGA1_5_N, DIMM_FPGA1_5_P, DIMM_FPGA1_6_N, DIMM_FPGA1_6_P, DIMM_FPGA1_7_N, DIMM_FPGA1_7_P, DIMM_FPGA1_8_N, DIMM_FPGA1_8_P, DIMM_FPGA1_9_N, DIMM_FPGA1_9_P, DIMM_FPGA1_10_N, DIMM_FPGA1_10_P, DIMM_FPGA1_11_N, DIMM_FPGA1_11_P, DIMM_FPGA1_12_N, DIMM_FPGA1_12_P, DIMM_FPGA1_13_N, DIMM_FPGA1_13_P, DIMM_FPGA1_14_N, DIMM_FPGA1_14_P, DIMM_FPGA1_15_N, DIMM_FPGA1_15_P, DIMM_FPGA1_16_N, DIMM_FPGA1_16_P, DIMM_FPGA1_17_N, DIMM_FPGA1_17_P, DIMM_FPGA1_18_N, DIMM_FPGA1_18_P, DIMM_FPGA1_19_N, DIMM_FPGA1_19_P, DIMM_FPGA1_20_N, DIMM_FPGA1_20_P, DIMM_FPGA1_21_N, DIMM_FPGA1_21_P, DIMM_FPGA1_22_N, DIMM_FPGA1_22_P, DIMM_FPGA2_1_N, DIMM_FPGA2_1_P, DIMM_FPGA2_2_N, DIMM_FPGA2_2_P, DIMM_FPGA2_3_N, DIMM_FPGA2_3_P, DIMM_FPGA2_4_N, DIMM_FPGA2_4_P, DIMM_FPGA2_5_N, DIMM_FPGA2_5_P, DIMM_FPGA2_6_N, DIMM_FPGA2_6_P, DIMM_FPGA2_7_N, DIMM_FPGA2_7_P, DIMM_FPGA2_8_N, DIMM_FPGA2_8_P, DIMM_FPGA2_9_N, DIMM_FPGA2_9_P, DIMM_FPGA2_10_N, DIMM_FPGA2_10_P, DIMM_FPGA2_11_N, DIMM_FPGA2_11_P, DIMM_FPGA2_12_N, DIMM_FPGA2_12_P, DIMM_FPGA2_13_N, DIMM_FPGA2_13_P, DIMM_FPGA2_14_N, DIMM_FPGA2_14_P, DIMM_FPGA2_15_N, DIMM_FPGA2_15_P, DIMM_FPGA2_16_N, DIMM_FPGA2_16_P, DIMM_FPGA2_17_N, DIMM_FPGA2_17_P, DIMM_FPGA2_18_N, DIMM_FPGA2_18_P, DIMM_FPGA2_19_N, DIMM_FPGA2_19_P, DIMM_FPGA2_20_N, DIMM_FPGA2_20_P, DIMM_FPGA2_21_N, DIMM_FPGA2_21_P, DIMM_FPGA2_22_N, DIMM_FPGA2_22_P

### Notes on the sheet
- Icarus DUAL Spartan6 Development Plarform
- 4
- 10
- 2.1a
- ngzhang

### Library data of the parts
RN4 = RES4PACK

## Sheet USB2UART.SchDoc
size A4
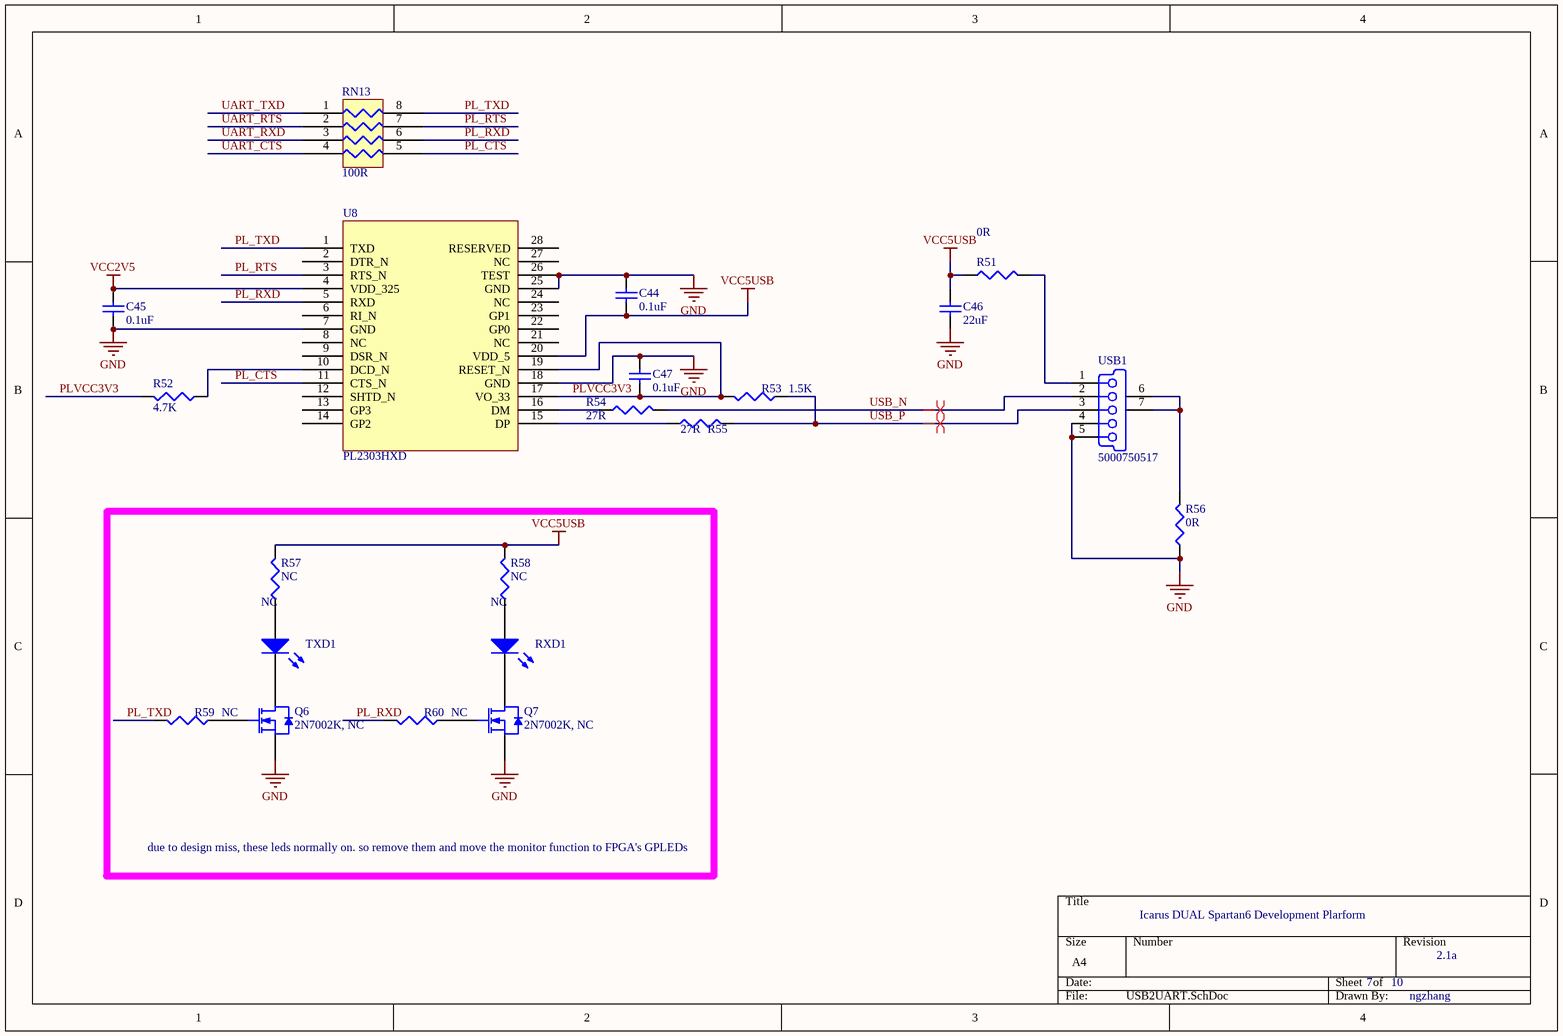
[diagram p5: USB2UART.SchDoc]

### Parts
C44  0.1uF  [1608[0603]]
C45  0.1uF  [1608[0603]]
C46  22uF  [C1206]
C47  0.1uF  [1608[0603]]
Q6  2N7002K, NC  [SOT23_N]
Q7  2N7002K, NC  [SOT23_N]
R51  0R  [J1-0603]
R52  4.7K  [J1-0603]
R53  1.5K  [J1-0603]
R54  27R  [J1-0603]
R55  27R  [J1-0603]
R56  0R  [J1-0603]
R57  NC  [J1-0603]
R58  NC  [J1-0603]
R59  NC  [J1-0603]
R60  NC  [J1-0603]
RN13  100R  [EXBV8V]
RXD1  NC  [CD1608-0603]
TXD1  NC  [CD1608-0603]
U8  PL2303HXD  [SSOP28_N]
USB1  5000750517  [5000750517]

### Nets
GND: C44.2 C45.1 C46.1 C47.2 Q6.2(S) Q7.2(S) R56.1 U8.7(GND) U8.18(GND) U8.25(GND) U8.26(TEST) USB1.4(ID) USB1.5(GND)
VCC2V5: C45.2 U8.4(VDD_325)  [project net VREF_OUT]
VCC5USB: C44.1 C46.2 R51.1 R57.2 R58.2 U8.20(VDD_5)
PL_CTS: RN13.5 U8.11(CTS_N)
PL_RTS: RN13.7 U8.3(RTS_N)
PL_RXD: R60.2 RN13.6 U8.5(RXD)
PL_TXD: R59.2 RN13.8 U8.1(TXD)
PLVCC3V3: C47.1 R52.2 R53.2 U8.17(VO_33) U8.19(RESET_N)
UART_CTS: RN13.4
UART_RTS: RN13.2
UART_RXD: RN13.3
UART_TXD: RN13.1
USB_N: R54.2 USB1.2(D-)
USB_P: R53.1 R55.2 USB1.3(D+)
NetQ6_1: Q6.1(G) R59.1
NetQ6_3: Q6.3(D) TXD1.2(K)
NetQ7_1: Q7.1(G) R60.1
NetQ7_3: Q7.3(D) RXD1.2(K)
NetR51_2: R51.2 USB1.1(V_BUS)
NetR52_1: R52.1 U8.10(DCD_N)
NetR54_1: R54.1 U8.16(DM)
NetR55_1: R55.1 U8.15(DP)
NetR56_2: R56.2 USB1.6(MH1) USB1.7(MH2)
NetR57_1: R57.1 TXD1.1(A)
NetR58_1: R58.1 RXD1.1(A)

Not connected (* = marked no-connect by the designer): U8 2(DTR_N) 6(RI_N) 8(NC) 9(DSR_N) 12(SHTD_N) 13(GP3) 14(GP2) 21(NC) 22(GP0) 23(GP1) 24(NC) 27(NC) 28(RESERVED)

### Layout directives
differential pair: USB_N, USB_P

### Notes on the sheet
- due to design miss, these leds normally on. so remove them and move the monitor function to FPGA's GPLEDs
- Icarus DUAL Spartan6 Development Plarform
- 7
- 10
- 2.1a
- ngzhang

### Library data of the parts
C44-C47 = Cap Semi: Capacitor (Semiconductor SIM Model); Published: 8-Jun-2000; LatestRevisionDate: 29-May-2009; LatestRevisionNote: IPC-7351 Footprint Added.; PackageReference: C1206; Publisher: Altium Limited; PackageDescription: Chip Capacitor
  C44 C45 C47: Value: 0.1uF
  C46: Value: 22uF
Q6 Q7 = 2N7002: as Q12 on sheet S6; Published: 17-Sep-2003; LatestRevisionDate: 12-Dec-2006; LatestRevisionNote: IPC-7351 Footprint Added.; DatasheetVersion: 27-Jul-2000; PackageVersion: May-1999; PackageReference: SOT23; Publisher: Altium Limited; PackageDescription: 3-Pin SOT-23 Package 0.95 mm Pitch, 2.3 mm Lead Span; ComponentLink1Description: Manufacturer Link; ComponentLink1URL: http://www.semiconductors.philips.com/; ComponentLink2Description: Datasheet; ComponentLink2URL: http://www.semiconductors.philips.com/acrobat/datasheets/2N7002_4.pdf
R51-R60 = Res3: Resistor; Published: 8-Jun-2000; LatestRevisionDate: 29-May-2009; LatestRevisionNote: IPC-7351 Footprint Added.; PackageReference: J1-0603; Publisher: Altium Limited; PackageDescription: Chip Resistor
  R51 R56: Value: 0R
  R52: Value: 4.7K
  R53: Value: 1.5K
  R54 R55: Value: 27R
  R57-R60: Value: NC
RN13 = RES4PACK
RXD1 TXD1 = LED3: Typical BLUE SiC LED; Published: 8-Jun-2000; LatestRevisionDate: 17-Dec-2003; LatestRevisionNote: PCB Footprint replaced.; DatasheetVersion: 16-Apr-2002; PackageVersion: 16-Apr-2002; PackageReference: 3.5X2.8X1.9; Publisher: Altium Limited; PackageDescription: SM LED; 2 C-Bend Leads; Body 3.5 x 2.8 x 1.9 mm, inc leads (LxWxH typ)
U8 = PL2303
USB1 = 5000750517: USB On-The-Go (OTG) Mini-B Receptacle, Right Angle, Thru-Hole, 0.80mm (.031") Pitch, Solder Tails & Shell Tabs with Dimples; PCB_Layout: Complies with Manufacturer's Recommendation.; Published: 30-May-2008; DatasheetVersion: rev0, Mar-2004; PackageVersion: rev0, Mar-2004; PackageReference: 5000750517; Publisher: Altium Limited; PackageDescription: USB Mini-B, Type 2, Thru-Hole; 5 Position; Vertical, Body 7.7 x 4.2 x 7.7 mm (LxWxH); ComponentLink1Description: Manufacturer Link; ComponentLink1URL: http://www.molex.com/; ComponentLink2Description: Datasheet; ComponentLink2URL: http://www.molex.com/pdm_docs/sd/5000750517_sd.pdf

## Sheet FPGA1_POWER.SchDoc
size A4
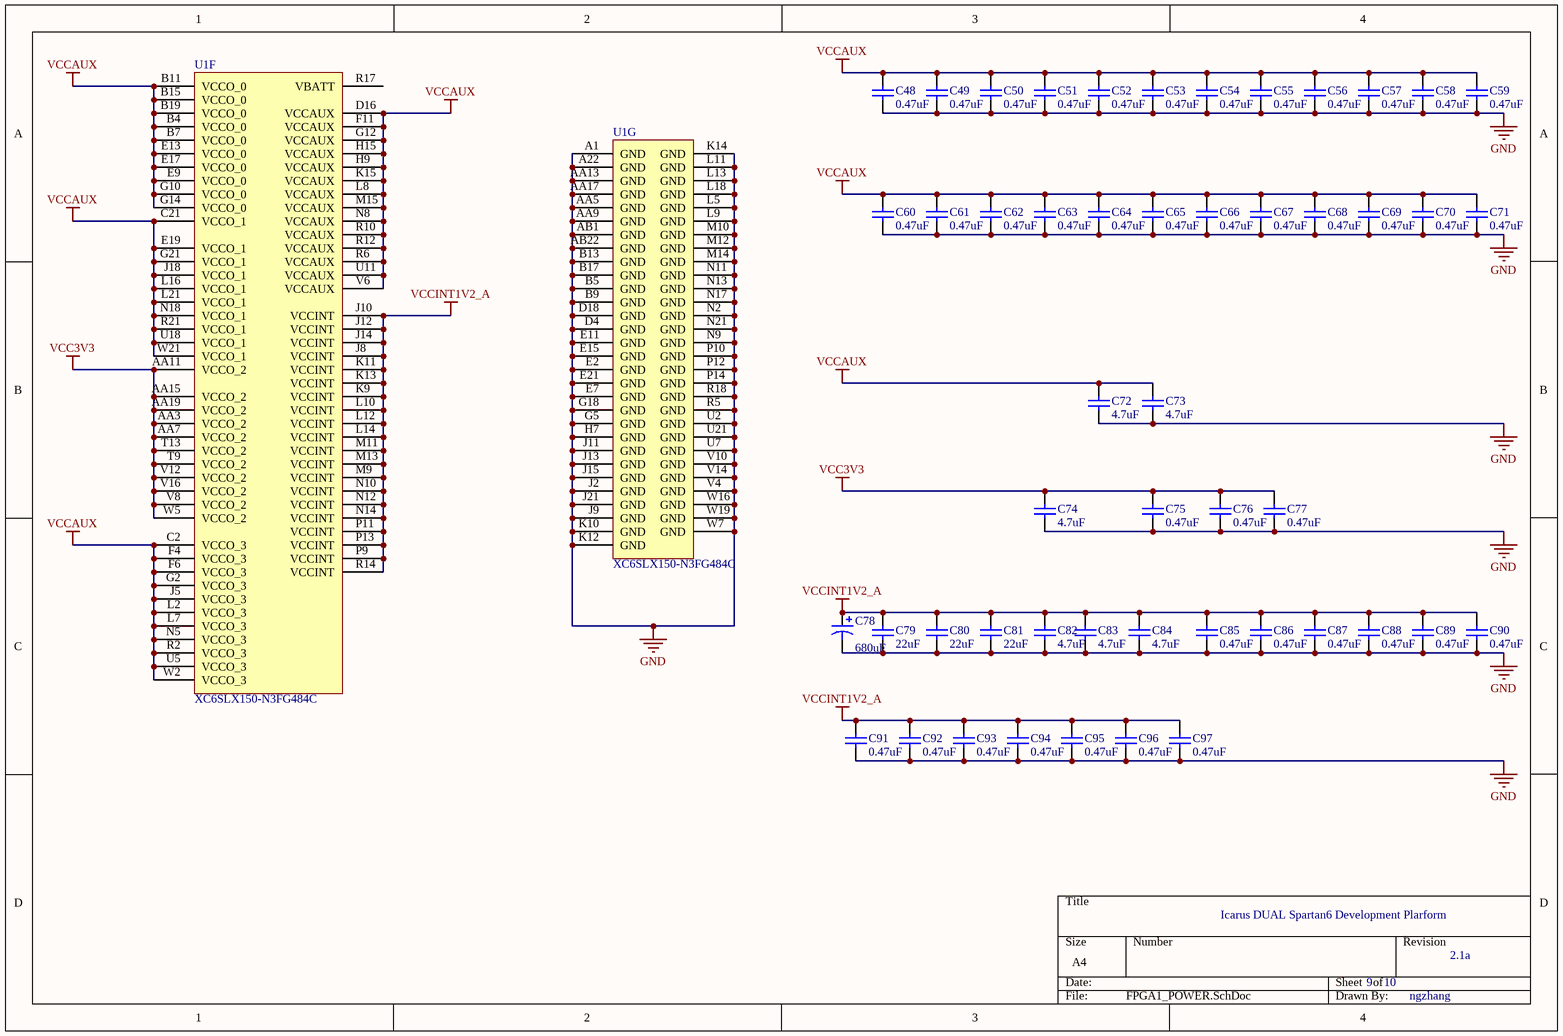
[diagram p6: FPGA1_POWER.SchDoc]

### Parts
C48  0.47uF  [0402]
C49  0.47uF  [0402]
C50  0.47uF  [0402]
C51  0.47uF  [0402]
C52  0.47uF  [0402]
C53  0.47uF  [0402]
C54  0.47uF  [0402]
C55  0.47uF  [0402]
C56  0.47uF  [0402]
C57  0.47uF  [0402]
C58  0.47uF  [0402]
C59  0.47uF  [0402]
C60  0.47uF  [0402]
C61  0.47uF  [0402]
C62  0.47uF  [0402]
C63  0.47uF  [0402]
C64  0.47uF  [0402]
C65  0.47uF  [0402]
C66  0.47uF  [0402]
C67  0.47uF  [0402]
C68  0.47uF  [0402]
C69  0.47uF  [0402]
C70  0.47uF  [0402]
C71  0.47uF  [0402]
C72  4.7uF  [C0805]
C73  4.7uF  [C0805]
C74  4.7uF  [C0805]
C75  0.47uF  [0402]
C76  0.47uF  [0402]
C77  0.47uF  [0402]
C78  680uF  [D]
C79  22uF  [C1206]
C80  22uF  [C1206]
C81  22uF  [C1206]
C82  4.7uF  [C0805]
C83  4.7uF  [C0805]
C84  4.7uF  [C0805]
C85  0.47uF  [0402]
C86  0.47uF  [0402]
C87  0.47uF  [0402]
C88  0.47uF  [0402]
C89  0.47uF  [0402]
C90  0.47uF  [0402]
C91  0.47uF  [0402]
C92  0.47uF  [0402]
C93  0.47uF  [0402]
C94  0.47uF  [0402]
C95  0.47uF  [0402]
C96  0.47uF  [0402]
C97  0.47uF  [0402]
U1  XC6SLX150-N3FG484C  [FG484]  (parts F,G of 7)

### Nets
GND: C48.1 C49.1 C50.1 C51.1 C52.1 C53.1 C54.1 C55.1 C56.1 C57.1 C58.1 C59.1 C60.1 C61.1 C62.1 C63.1 C64.1 C65.1 C66.1 C67.1 C68.1 C69.1 C70.1 C71.1 C72.1 C73.1 C74.1 C75.1 C76.1 C77.1 C78.2 C79.1 C80.1 C81.1 C82.1 C83.1 C84.1 C85.1 C86.1 C87.1 C88.1 C89.1 C90.1 C91.1 C92.1 C93.1 C94.1 C95.1 C96.1 C97.1 U1.A1(GND) U1.A22(GND) U1.AA5(GND) U1.AA9(GND) U1.AA13(GND) U1.AA17(GND) U1.AB1(GND) U1.AB22(GND) U1.B5(GND) U1.B9(GND) U1.B13(GND) U1.B17(GND) U1.D4(GND) U1.D18(GND) U1.E2(GND) U1.E7(GND) U1.E11(GND) U1.E15(GND) U1.E21(GND) U1.G5(GND) U1.G18(GND) U1.H7(GND) U1.J2(GND) U1.J9(GND) U1.J11(GND) U1.J13(GND) U1.J15(GND) U1.J21(GND) U1.K10(GND) U1.K12(GND) U1.K14(GND) U1.L5(GND) U1.L9(GND) U1.L11(GND) U1.L13(GND) U1.L18(GND) U1.M10(GND) U1.M12(GND) U1.M14(GND) U1.N2(GND) U1.N9(GND) U1.N11(GND) U1.N13(GND) U1.N17(GND) U1.N21(GND) U1.P10(GND) U1.P12(GND) U1.P14(GND) U1.R5(GND) U1.R18(GND) U1.U2(GND) U1.U7(GND) U1.U21(GND) U1.V4(GND) U1.V10(GND) U1.V14(GND) U1.W7(GND) U1.W16(GND) U1.W19(GND)
VCC3V3: C74.2 C75.2 C76.2 C77.2 U1.AA3(VCCO_2) U1.AA7(VCCO_2) U1.AA11(VCCO_2) U1.AA15(VCCO_2) U1.AA19(VCCO_2) U1.T9(VCCO_2) U1.T13(VCCO_2) U1.V8(VCCO_2) U1.V12(VCCO_2) U1.V16(VCCO_2) U1.W5(VCCO_2)
VCCAUX: C48.2 C49.2 C50.2 C51.2 C52.2 C53.2 C54.2 C55.2 C56.2 C57.2 C58.2 C59.2 C60.2 C61.2 C62.2 C63.2 C64.2 C65.2 C66.2 C67.2 C68.2 C69.2 C70.2 C71.2 C72.2 C73.2 U1.B4(VCCO_0) U1.B7(VCCO_0) U1.B11(VCCO_0) U1.B15(VCCO_0) U1.B19(VCCO_0) U1.C2(VCCO_3) U1.C21(VCCO_1) U1.D16(VCCAUX) U1.E9(VCCO_0) U1.E13(VCCO_0) U1.E17(VCCO_0) U1.E19(VCCO_1) U1.F4(VCCO_3) U1.F6(VCCO_3) U1.F11(VCCAUX) U1.G2(VCCO_3) U1.G10(VCCO_0) U1.G12(VCCAUX) U1.G14(VCCO_0) U1.G21(VCCO_1) U1.H9(VCCAUX) U1.H15(VCCAUX) U1.J5(VCCO_3) U1.J18(VCCO_1) U1.K15(VCCAUX) U1.L2(VCCO_3) U1.L7(VCCO_3) U1.L8(VCCAUX) U1.L16(VCCO_1) U1.L21(VCCO_1) U1.M15(VCCAUX) U1.N5(VCCO_3) U1.N8(VCCAUX) U1.N18(VCCO_1) U1.R2(VCCO_3) U1.R6(VCCAUX) U1.R10(VCCAUX) U1.R12(VCCAUX) U1.R21(VCCO_1) U1.U5(VCCO_3) U1.U11(VCCAUX) U1.U18(VCCO_1) U1.V6(VCCAUX) U1.W2(VCCO_3) U1.W21(VCCO_1)  [project net VREF_OUT]
VCCINT1V2_A: C78.1 C79.2 C80.2 C81.2 C82.2 C83.2 C84.2 C85.2 C86.2 C87.2 C88.2 C89.2 C90.2 C91.2 C92.2 C93.2 C94.2 C95.2 C96.2 C97.2 U1.J8(VCCINT) U1.J10(VCCINT) U1.J12(VCCINT) U1.J14(VCCINT) U1.K9(VCCINT) U1.K11(VCCINT) U1.K13(VCCINT) U1.L10(VCCINT) U1.L12(VCCINT) U1.L14(VCCINT) U1.M9(VCCINT) U1.M11(VCCINT) U1.M13(VCCINT) U1.N10(VCCINT) U1.N12(VCCINT) U1.N14(VCCINT) U1.P9(VCCINT) U1.P11(VCCINT) U1.P13(VCCINT) U1.R14(VCCINT)

Not connected (* = marked no-connect by the designer): U1 R17(VBATT)

### Notes on the sheet
- Icarus DUAL Spartan6 Development Plarform
- 9
- 10
- 2.1a
- ngzhang

### Library data of the parts
C48-C77 C79-C97 = Cap Semi: Capacitor (Semiconductor SIM Model); Published: 8-Jun-2000; LatestRevisionDate: 29-May-2009; LatestRevisionNote: IPC-7351 Footprint Added.; PackageReference: C1206; Publisher: Altium Limited; PackageDescription: Chip Capacitor
  C48-C71 C75-C77 C85-C97: Value: 0.47uF
  C72-C74 C82-C84: Value: 4.7uF
  C79-C81: Value: 22uF
C78 = Cap Pol3: Polarized Capacitor (Surface Mount); Published: 8-Jun-2000; LatestRevisionDate: 29-May-2009; LatestRevisionNote: IPC-7351 Footprint Added.; PackageReference: C0805; Publisher: Altium Limited; PackageDescription: Chip Capacitor; Value: 680uF
U1 = XC6SLX150-N3FG484C: Spartan-6 LX 1.2V FPGA, 338 User I/Os, 484-Ball Fine-Pitch BGA (1.0mm Pitch), Speed Grade 3N, Commercial Grade; Published: 24-Aug-2010; DatasheetVersion: ver1.6, Nov-2010; PackageVersion: ver1.1, Dec-2008; PackageReference: FG484; Publisher: Altium Limited; PackageDescription: 484-Ball Fine Pitch Ball Grid Array 1.00 mm Pitch (FG484); Code_JEDEC: MS-034-AAJ-1; Code_IPC: BGA100P22X22-484; ComponentLink1Description: Manufacturer Link; ComponentLink1URL: http://www.xilinx.com; ComponentLink2Description: Spartan-6 Datasheet; ComponentLink2URL: http://www.xilinx.com/support/documentation/data_sheets/ds160.pdf; ComponentLink3Description: Spartan-6 Documents; ComponentLink3URL: http://www.xilinx.com/support/documentation/spartan-6.htm; ComponentLink4Description: Xilinx.com Home; ComponentLink4URL: http://www.xilinx.com

## Sheet FPGA2_POWER.SchDoc
size A4
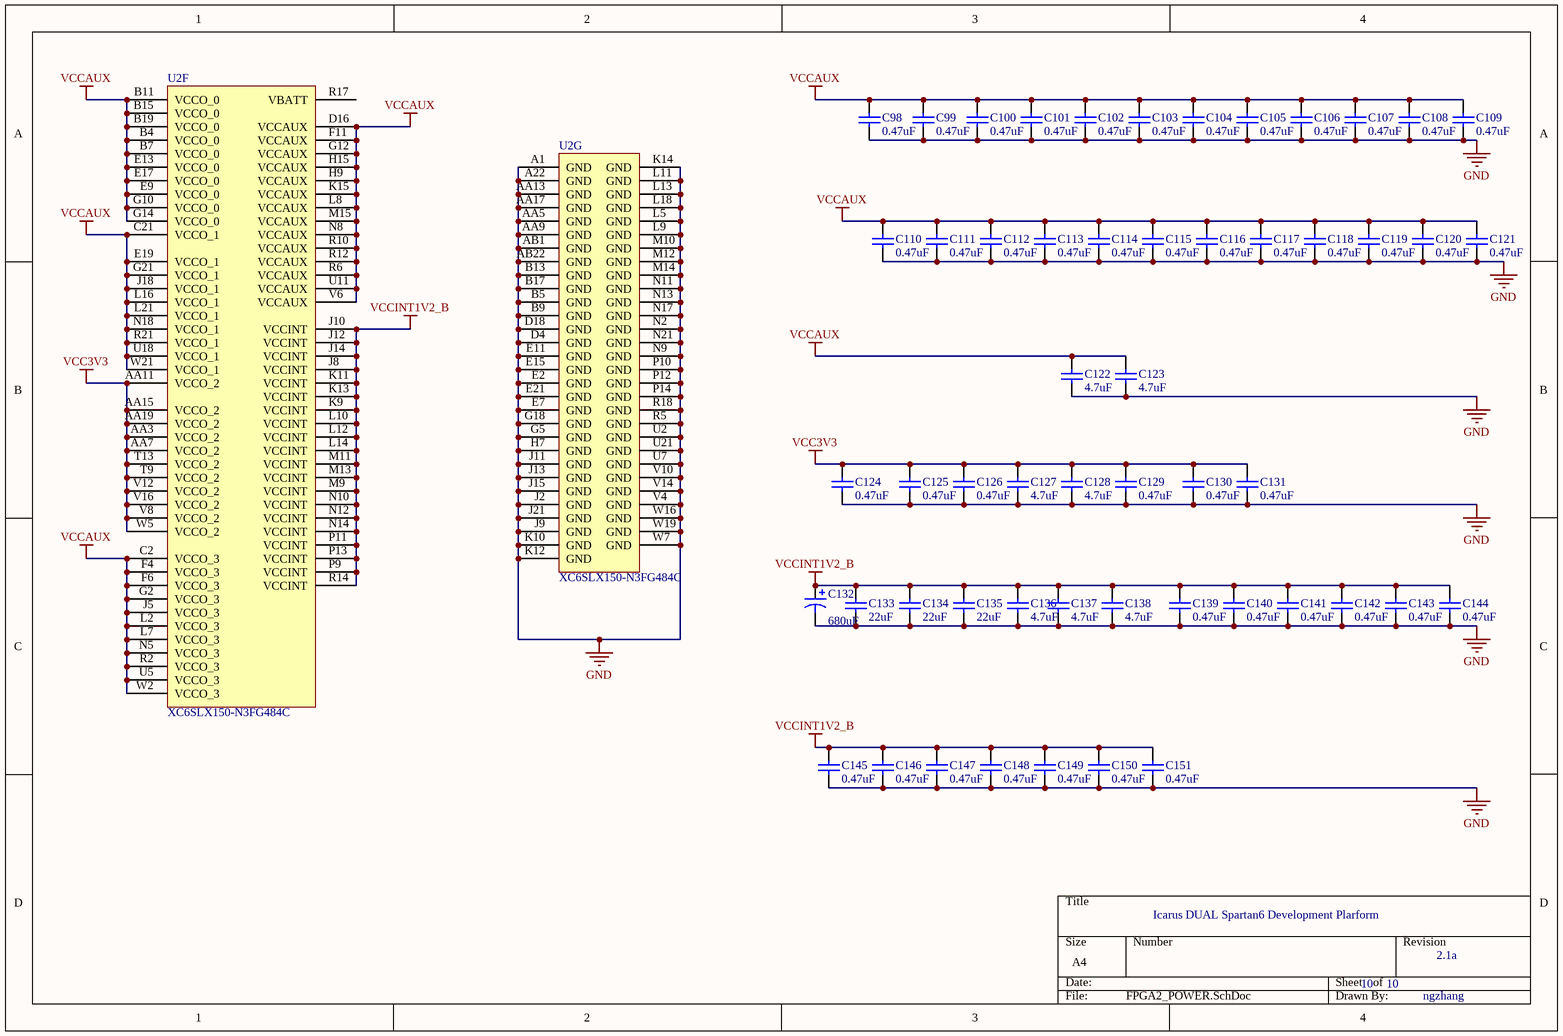
[diagram p7: FPGA2_POWER.SchDoc]

### Parts
C98  0.47uF  [0402]
C99  0.47uF  [0402]
C100  0.47uF  [0402]
C101  0.47uF  [0402]
C102  0.47uF  [0402]
C103  0.47uF  [0402]
C104  0.47uF  [0402]
C105  0.47uF  [0402]
C106  0.47uF  [0402]
C107  0.47uF  [0402]
C108  0.47uF  [0402]
C109  0.47uF  [0402]
C110  0.47uF  [0402]
C111  0.47uF  [0402]
C112  0.47uF  [0402]
C113  0.47uF  [0402]
C114  0.47uF  [0402]
C115  0.47uF  [0402]
C116  0.47uF  [0402]
C117  0.47uF  [0402]
C118  0.47uF  [0402]
C119  0.47uF  [0402]
C120  0.47uF  [0402]
C121  0.47uF  [0402]
C122  4.7uF  [C0805]
C123  4.7uF  [C0805]
C124  0.47uF  [0402]
C125  0.47uF  [0402]
C126  0.47uF  [0402]
C127  4.7uF  [C0805]
C128  4.7uF  [C0805]
C129  0.47uF  [0402]
C130  0.47uF  [0402]
C131  0.47uF  [0402]
C132  680uF  [D]
C133  22uF  [C1206]
C134  22uF  [C1206]
C135  22uF  [C1206]
C136  4.7uF  [C0805]
C137  4.7uF  [C0805]
C138  4.7uF  [C0805]
C139  0.47uF  [0402]
C140  0.47uF  [0402]
C141  0.47uF  [0402]
C142  0.47uF  [0402]
C143  0.47uF  [0402]
C144  0.47uF  [0402]
C145  0.47uF  [0402]
C146  0.47uF  [0402]
C147  0.47uF  [0402]
C148  0.47uF  [0402]
C149  0.47uF  [0402]
C150  0.47uF  [0402]
C151  0.47uF  [0402]
U2  XC6SLX150-N3FG484C  [FG484]  (parts F,G of 7)

### Nets
GND: C98.1 C99.1 C100.1 C101.1 C102.1 C103.1 C104.1 C105.1 C106.1 C107.1 C108.1 C109.1 C110.1 C111.1 C112.1 C113.1 C114.1 C115.1 C116.1 C117.1 C118.1 C119.1 C120.1 C121.1 C122.1 C123.1 C124.1 C125.1 C126.1 C127.1 C128.1 C129.1 C130.1 C131.1 C132.2 C133.1 C134.1 C135.1 C136.1 C137.1 C138.1 C139.1 C140.1 C141.1 C142.1 C143.1 C144.1 C145.1 C146.1 C147.1 C148.1 C149.1 C150.1 C151.1 U2.A1(GND) U2.A22(GND) U2.AA5(GND) U2.AA9(GND) U2.AA13(GND) U2.AA17(GND) U2.AB1(GND) U2.AB22(GND) U2.B5(GND) U2.B9(GND) U2.B13(GND) U2.B17(GND) U2.D4(GND) U2.D18(GND) U2.E2(GND) U2.E7(GND) U2.E11(GND) U2.E15(GND) U2.E21(GND) U2.G5(GND) U2.G18(GND) U2.H7(GND) U2.J2(GND) U2.J9(GND) U2.J11(GND) U2.J13(GND) U2.J15(GND) U2.J21(GND) U2.K10(GND) U2.K12(GND) U2.K14(GND) U2.L5(GND) U2.L9(GND) U2.L11(GND) U2.L13(GND) U2.L18(GND) U2.M10(GND) U2.M12(GND) U2.M14(GND) U2.N2(GND) U2.N9(GND) U2.N11(GND) U2.N13(GND) U2.N17(GND) U2.N21(GND) U2.P10(GND) U2.P12(GND) U2.P14(GND) U2.R5(GND) U2.R18(GND) U2.U2(GND) U2.U7(GND) U2.U21(GND) U2.V4(GND) U2.V10(GND) U2.V14(GND) U2.W7(GND) U2.W16(GND) U2.W19(GND)
VCC3V3: C124.2 C125.2 C126.2 C127.2 C128.2 C129.2 C130.2 C131.2 U2.AA3(VCCO_2) U2.AA7(VCCO_2) U2.AA11(VCCO_2) U2.AA15(VCCO_2) U2.AA19(VCCO_2) U2.T9(VCCO_2) U2.T13(VCCO_2) U2.V8(VCCO_2) U2.V12(VCCO_2) U2.V16(VCCO_2) U2.W5(VCCO_2)
VCCAUX: C98.2 C99.2 C100.2 C101.2 C102.2 C103.2 C104.2 C105.2 C106.2 C107.2 C108.2 C109.2 C110.2 C111.2 C112.2 C113.2 C114.2 C115.2 C116.2 C117.2 C118.2 C119.2 C120.2 C121.2 C122.2 C123.2 U2.B4(VCCO_0) U2.B7(VCCO_0) U2.B11(VCCO_0) U2.B15(VCCO_0) U2.B19(VCCO_0) U2.C2(VCCO_3) U2.C21(VCCO_1) U2.D16(VCCAUX) U2.E9(VCCO_0) U2.E13(VCCO_0) U2.E17(VCCO_0) U2.E19(VCCO_1) U2.F4(VCCO_3) U2.F6(VCCO_3) U2.F11(VCCAUX) U2.G2(VCCO_3) U2.G10(VCCO_0) U2.G12(VCCAUX) U2.G14(VCCO_0) U2.G21(VCCO_1) U2.H9(VCCAUX) U2.H15(VCCAUX) U2.J5(VCCO_3) U2.J18(VCCO_1) U2.K15(VCCAUX) U2.L2(VCCO_3) U2.L7(VCCO_3) U2.L8(VCCAUX) U2.L16(VCCO_1) U2.L21(VCCO_1) U2.M15(VCCAUX) U2.N5(VCCO_3) U2.N8(VCCAUX) U2.N18(VCCO_1) U2.R2(VCCO_3) U2.R6(VCCAUX) U2.R10(VCCAUX) U2.R12(VCCAUX) U2.R21(VCCO_1) U2.U5(VCCO_3) U2.U11(VCCAUX) U2.U18(VCCO_1) U2.V6(VCCAUX) U2.W2(VCCO_3) U2.W21(VCCO_1)  [project net VREF_OUT]
VCCINT1V2_B: C132.1 C133.2 C134.2 C135.2 C136.2 C137.2 C138.2 C139.2 C140.2 C141.2 C142.2 C143.2 C144.2 C145.2 C146.2 C147.2 C148.2 C149.2 C150.2 C151.2 U2.J8(VCCINT) U2.J10(VCCINT) U2.J12(VCCINT) U2.J14(VCCINT) U2.K9(VCCINT) U2.K11(VCCINT) U2.K13(VCCINT) U2.L10(VCCINT) U2.L12(VCCINT) U2.L14(VCCINT) U2.M9(VCCINT) U2.M11(VCCINT) U2.M13(VCCINT) U2.N10(VCCINT) U2.N12(VCCINT) U2.N14(VCCINT) U2.P9(VCCINT) U2.P11(VCCINT) U2.P13(VCCINT) U2.R14(VCCINT)

Not connected (* = marked no-connect by the designer): U2 R17(VBATT)

### Notes on the sheet
- Icarus DUAL Spartan6 Development Plarform
- 10
- 2.1a
- ngzhang

### Library data of the parts
C98-C131 C133-C151 = Cap Semi: Capacitor (Semiconductor SIM Model); Published: 8-Jun-2000; LatestRevisionDate: 29-May-2009; LatestRevisionNote: IPC-7351 Footprint Added.; PackageReference: C1206; Publisher: Altium Limited; PackageDescription: Chip Capacitor
  C98-C121 C124-C126 C129-C131 C139-C151: Value: 0.47uF
  C122 C123 C127 C128 C136-C138: Value: 4.7uF
  C133-C135: Value: 22uF
C132 = Cap Pol3: Polarized Capacitor (Surface Mount); Published: 8-Jun-2000; LatestRevisionDate: 29-May-2009; LatestRevisionNote: IPC-7351 Footprint Added.; PackageReference: C0805; Publisher: Altium Limited; PackageDescription: Chip Capacitor; Value: 680uF
U2 = XC6SLX150-N3FG484C: as U1 on sheet FPGA1_POWER; Published: 24-Aug-2010; DatasheetVersion: ver1.6, Nov-2010; PackageVersion: ver1.1, Dec-2008; PackageReference: FG484; Publisher: Altium Limited; PackageDescription: 484-Ball Fine Pitch Ball Grid Array 1.00 mm Pitch (FG484); Code_JEDEC: MS-034-AAJ-1; Code_IPC: BGA100P22X22-484; ComponentLink1Description: Manufacturer Link; ComponentLink1URL: http://www.xilinx.com; ComponentLink2Description: Spartan-6 Datasheet; ComponentLink2URL: http://www.xilinx.com/support/documentation/data_sheets/ds160.pdf; ComponentLink3Description: Spartan-6 Documents; ComponentLink3URL: http://www.xilinx.com/support/documentation/spartan-6.htm; ComponentLink4Description: Xilinx.com Home; ComponentLink4URL: http://www.xilinx.com

## Nets that join several sheets
GND: S6 (76 pins), POWER_IO (33 pins), POWER (45 pins), DIMM_CONNECTOR (115 pins), USB2UART (13 pins), FPGA1_POWER (109 pins), FPGA2_POWER (113 pins)
VCC3V3: S6 (C34.2 C36.1 R47.2 U7.8), POWER_IO (7 pins), FPGA1_POWER (15 pins), FPGA2_POWER (19 pins)
VCC12V: S6 (8 pins), POWER_IO (C152.2 C163.2 R61.2 R70.2), POWER (7 pins), DIMM_CONNECTOR (32 pins)
VCCINT1V2_A: POWER (8 pins), FPGA1_POWER (40 pins)
VCCINT1V2_B: POWER (8 pins), FPGA2_POWER (40 pins)
VREF_OUT: S6 (18 pins), POWER_IO (6 pins), POWER (R39.2), DIMM_CONNECTOR (DIMM1.42), USB2UART (C45.2 U8.4), FPGA1_POWER (71 pins), FPGA2_POWER (71 pins)
FANEN: S6 (Q12.1 Q13.1), POWER (Q11.3 R81.2)
IO_PG: POWER_IO (R76.1 TP11.1 U10.4), POWER (U5.1)
PWR_ON: POWER_IO (U9.7), POWER (C18.2 S1.2 TP4.1)